# EAGLE schematic motherboard_g4_V1.3 (EAGLE 7.7.0)

## Sheet 1 of 7: CPU
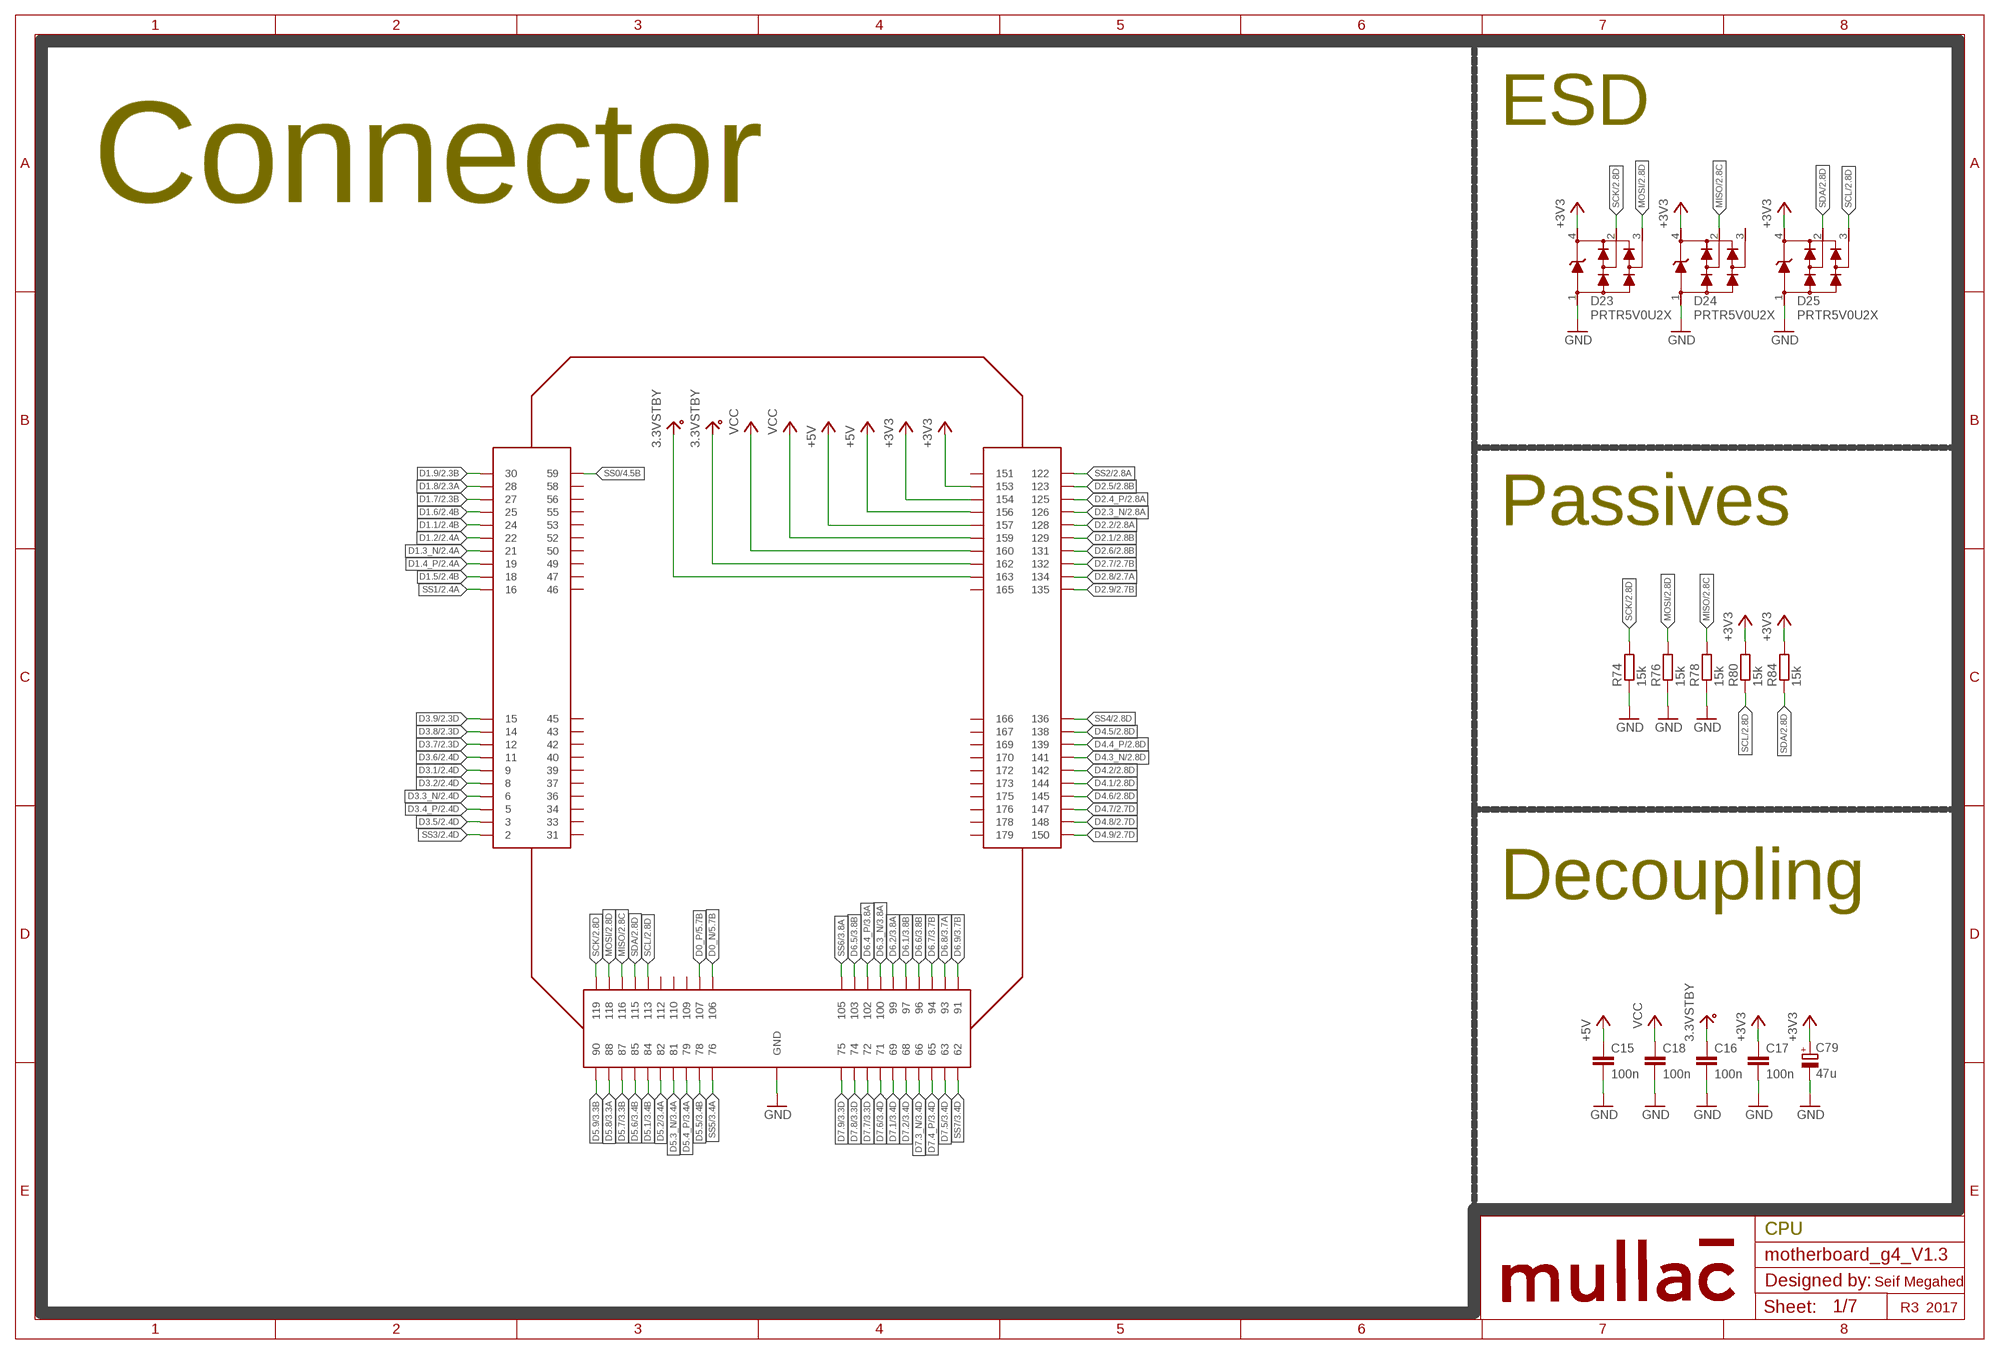
[diagram p0: schematic, sheet 1]

### Parts
C15  100n  CAP_0603  [CAP_0603]
C16  100n  CAP_0603  [CAP_0603]
C17  100n  CAP_0603  [CAP_0603]
C18  100n  CAP_0603  [CAP_0603]
C79  47u  CPOL-EUC  [PANASONIC_C]
D23  PRTR5V0U2X  [SOT143B]
D24  PRTR5V0U2X  [SOT143B]
D25  PRTR5V0U2X  [SOT143B]
R74  15k  RES0603  [RES_0603]
R76  15k  RES0603  [RES_0603]
R78  15k  RES0603  [RES_0603]
R80  15k  RES0603  [RES_0603]
R84  15k  RES0603  [RES_0603]
U$4  SSH-G4-CPUDOCK  [SSH-CPU-DOCK]

### Nets
+3V3: C17.1 C79.+ D23.4 D24.4 D25.4 R80.2 R84.2 U$4.153 U$4.154 ; also sheet 2,3,4,5,6,7
+5V: C15.1 U$4.156 U$4.157 ; also sheet 2,3,7
D0_N [Differential]: U$4.106 ; also sheet 5
D0_P [Differential]: U$4.107 ; also sheet 5
D1.1: U$4.24 ; also sheet 2
D1.2: U$4.22 ; also sheet 2
D1.3_N: U$4.21 ; also sheet 2
D1.4_P: U$4.19 ; also sheet 2
D1.5: U$4.18 ; also sheet 2
D1.6: U$4.25 ; also sheet 2
D1.7: U$4.27 ; also sheet 2
D1.8: U$4.28 ; also sheet 2
D1.9: U$4.30 ; also sheet 2
D2.1: U$4.129 ; also sheet 2
D2.2: U$4.128 ; also sheet 2
D2.3_N: U$4.126 ; also sheet 2
D2.4_P: U$4.125 ; also sheet 2
D2.5: U$4.123 ; also sheet 2
D2.6: U$4.131 ; also sheet 2
D2.7: U$4.132 ; also sheet 2
D2.8: U$4.134 ; also sheet 2
D2.9: U$4.135 ; also sheet 2
D3.1: U$4.9 ; also sheet 2
D3.2: U$4.8 ; also sheet 2
D3.3_N: U$4.6 ; also sheet 2
D3.4_P: U$4.5 ; also sheet 2
D3.5: U$4.3 ; also sheet 2
D3.6: U$4.11 ; also sheet 2
D3.7: U$4.12 ; also sheet 2
D3.8: U$4.14 ; also sheet 2
D3.9: U$4.15 ; also sheet 2
D4.1: U$4.144 ; also sheet 2
D4.2: U$4.142 ; also sheet 2
D4.3_N: U$4.141 ; also sheet 2
D4.4_P: U$4.139 ; also sheet 2
D4.5: U$4.138 ; also sheet 2
D4.6: U$4.145 ; also sheet 2
D4.7: U$4.147 ; also sheet 2
D4.8: U$4.148 ; also sheet 2
D4.9: U$4.150 ; also sheet 2
D5.1: U$4.84 ; also sheet 3
D5.2: U$4.82 ; also sheet 3
D5.3_N: U$4.81 ; also sheet 3
D5.4_P: U$4.79 ; also sheet 3
D5.5: U$4.78 ; also sheet 3
D5.6: U$4.85 ; also sheet 3
D5.7: U$4.87 ; also sheet 3
D5.8: U$4.88 ; also sheet 3
D5.9: U$4.90 ; also sheet 3
D6.1: U$4.97 ; also sheet 3
D6.2: U$4.99 ; also sheet 3
D6.3_N: U$4.100 ; also sheet 3
D6.4_P: U$4.102 ; also sheet 3
D6.5: U$4.103 ; also sheet 3
D6.6: U$4.96 ; also sheet 3
D6.7: U$4.94 ; also sheet 3
D6.8: U$4.93 ; also sheet 3
D6.9: U$4.91 ; also sheet 3
D7.1: U$4.69 ; also sheet 3
D7.2: U$4.68 ; also sheet 3
D7.3_N: U$4.66 ; also sheet 3
D7.4_P: U$4.65 ; also sheet 3
D7.5: U$4.63 ; also sheet 3
D7.6: U$4.71 ; also sheet 3
D7.7: U$4.72 ; also sheet 3
D7.8: U$4.74 ; also sheet 3
D7.9: U$4.75 ; also sheet 3
GND: C15.2 C16.2 C17.2 C18.2 C79.- D23.1 D24.1 D25.1 R74.1 R76.1 R78.1 U$4.1(GND) U$4.4(GND) U$4.7(GND) U$4.10(GND) U$4.13(GND) U$4.17(GND) U$4.20(GND) U$4.23(GND) U$4.26(GND) U$4.29(GND) U$4.32(GND) U$4.35(GND) U$4.38(GND) U$4.41(GND) U$4.44(GND) U$4.48(GND) U$4.51(GND) U$4.54(GND) U$4.57(GND) U$4.60(GND) U$4.61(GND) U$4.64(GND) U$4.67(GND) U$4.70(GND) U$4.73(GND) U$4.77(GND) U$4.80(GND) U$4.83(GND) U$4.86(GND) U$4.89(GND) U$4.92(GND) U$4.95(GND) U$4.98(GND) U$4.101(GND) U$4.104(GND) U$4.108(GND) U$4.111(GND) U$4.114(GND) U$4.117(GND) U$4.120(GND) U$4.121(GND) U$4.124(GND) U$4.127(GND) U$4.130(GND) U$4.133(GND) U$4.137(GND) U$4.140(GND) U$4.143(GND) U$4.146(GND) U$4.149(GND) U$4.152(GND) U$4.155(GND) U$4.158(GND) U$4.161(GND) U$4.164(GND) U$4.168(GND) U$4.171(GND) U$4.174(GND) U$4.177(GND) U$4.180(GND) U$4.P$1(GND) U$4.P$2(GND) U$4.P$3(GND) U$4.P$4(GND) U$4.P$23(GND) U$4.P$24(GND) ; also sheet 2,3,4,5,6,7
MISO: D24.2 R78.2 U$4.116 ; also sheet 2,3,4
MOSI: D23.3 R76.2 U$4.118 ; also sheet 2,3,4
SCK: D23.2 R74.2 U$4.119 ; also sheet 2,3,4
SCL: D25.3 R80.1 U$4.113 ; also sheet 2,3,4
SDA: D25.2 R84.1 U$4.115 ; also sheet 2,3,4
SS0: U$4.59 ; also sheet 4
SS1: U$4.16 ; also sheet 2
SS2: U$4.122 ; also sheet 2
SS3: U$4.2 ; also sheet 2
SS4: U$4.136 ; also sheet 2
SS5: U$4.76 ; also sheet 3
SS6: U$4.105 ; also sheet 3
SS7: U$4.62 ; also sheet 3
STDBY3V3: C16.1 U$4.162 U$4.163 ; supply symbol labelled 3.3VSTBY
VCC: C18.1 U$4.159 U$4.160 ; also sheet 2,3,6,7
Unconnected: D24.3 U$4.31 U$4.33 U$4.34 U$4.36 U$4.37 U$4.39 U$4.40 U$4.42 U$4.43 U$4.45 U$4.46 U$4.47 U$4.49 U$4.50 U$4.52 U$4.53 U$4.55 U$4.56 U$4.58 U$4.109 U$4.110 U$4.112 U$4.151 U$4.165 U$4.166 U$4.167 U$4.169 U$4.170 U$4.172 U$4.173 U$4.175 U$4.176 U$4.178 U$4.179

### Notes on the sheet
- ESD
- Connector
- Passives
- Decoupling
- CPU | CPU
- Seif Megahed
- R3 | 2017

## Sheet 2 of 7: Modules 1
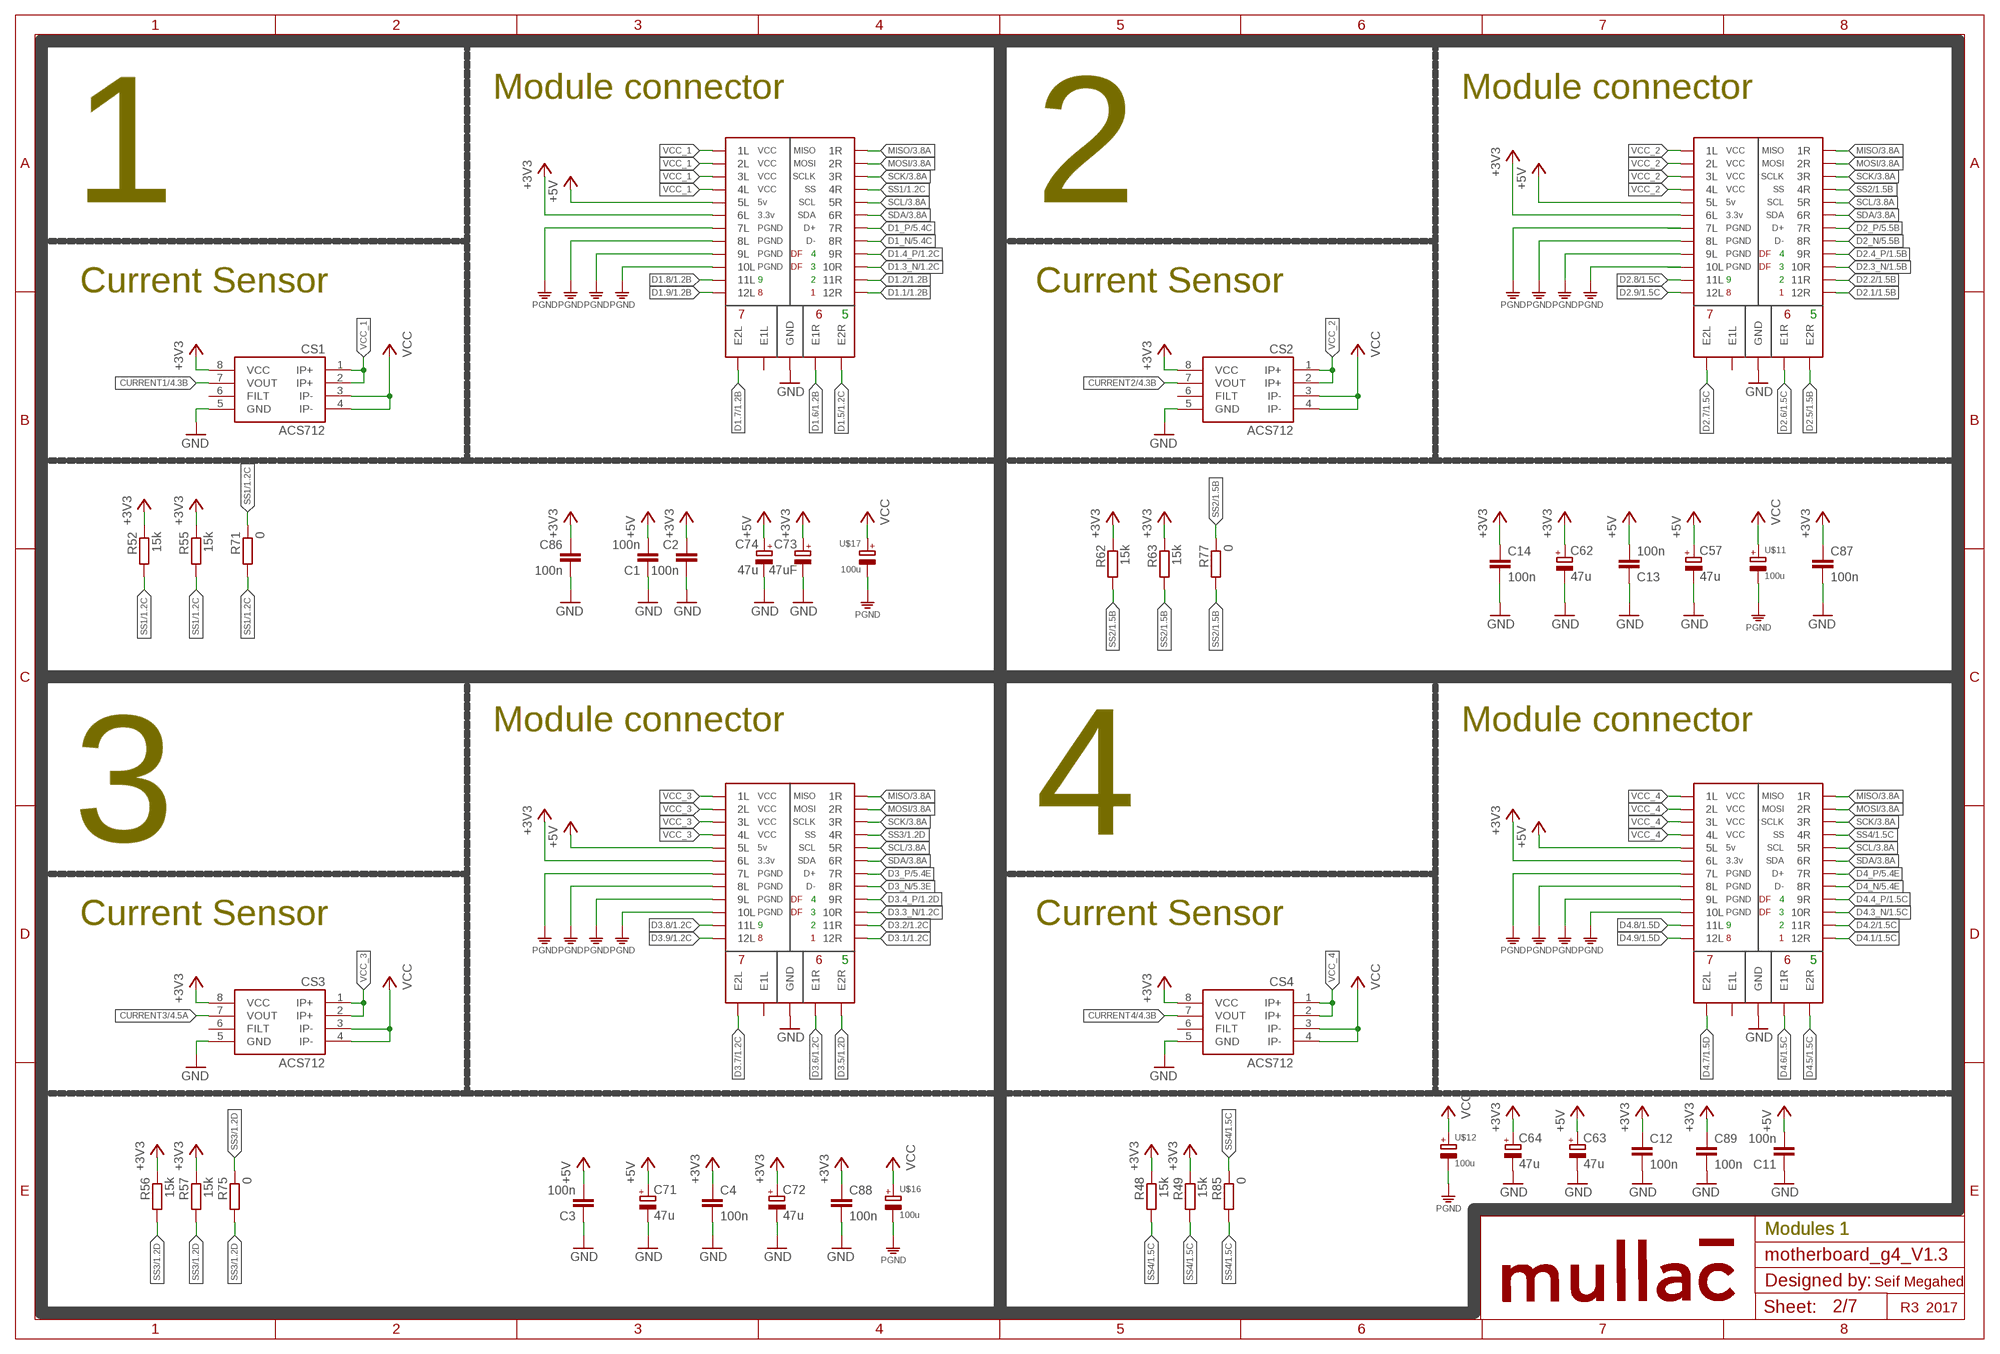
[diagram p1: schematic, sheet 2]

### Parts
C1  100n  CAP_0603  [CAP_0603]
C2  100n  CAP_0603  [CAP_0603]
C3  100n  CAP_0603  [CAP_0603]
C4  100n  CAP_0603  [CAP_0603]
C11  100n  CAP_0603  [CAP_0603]
C12  100n  CAP_0603  [CAP_0603]
C13  100n  CAP_0603  [CAP_0603]
C14  100n  CAP_0603  [CAP_0603]
C57  47u  CPOL-EUC  [PANASONIC_C]
C62  47u  CPOL-EUC  [PANASONIC_C]
C63  47u  CPOL-EUC  [PANASONIC_C]
C64  47u  CPOL-EUC  [PANASONIC_C]
C71  47u  CPOL-EUC  [PANASONIC_C]
C72  47u  CPOL-EUC  [PANASONIC_C]
C73  47uF  CPOL-EUC  [PANASONIC_C]
C74  47u  CPOL-EUC  [PANASONIC_C]
C86  100n  CAP_0603  [CAP_0603]
C87  100n  CAP_0603  [CAP_0603]
C88  100n  CAP_0603  [CAP_0603]
C89  100n  CAP_0603  [CAP_0603]
CS1  ACS712  [SO08]
CS2  ACS712  [SO08]
CS3  ACS712  [SO08]
CS4  ACS712  [SO08]
R48  15k  RES0603  [RES_0603]
R49  15k  RES0603  [RES_0603]
R52  15k  RES0603  [RES_0603]
R55  15k  RES0603  [RES_0603]
R56  15k  RES0603  [RES_0603]
R57  15k  RES0603  [RES_0603]
R62  15k  RES0603  [RES_0603]
R63  15k  RES0603  [RES_0603]
R71  0  RES0603  [RES_0603]
R75  0  RES0603  [RES_0603]
R77  0  RES0603  [RES_0603]
R85  0  RES0603  [RES_0603]
U$5  SSH-G4-MODULEDOCK  [SSH-G4-DOCK]
U$6  SSH-G4-MODULEDOCK  [SSH-G4-DOCK]
U$7  SSH-G4-MODULEDOCK  [SSH-G4-DOCK]
U$8  SSH-G4-MODULEDOCK  [SSH-G4-DOCK]
U$11  100u  CAPACITOR_POLA_EEEFK1V101XP  [AE_CAP_D]
U$12  100u  CAPACITOR_POLA_EEEFK1V101XP  [AE_CAP_D]
U$16  100u  CAPACITOR_POLA_EEEFK1V101XP  [AE_CAP_D]
U$17  100u  CAPACITOR_POLA_EEEFK1V101XP  [AE_CAP_D]

### Nets
+3V3: C2.1 C4.1 C12.1 C14.1 C62.+ C64.+ C72.+ C73.+ C86.1 C87.1 C88.1 C89.1 CS1.8(VCC) CS2.8(VCC) CS3.8(VCC) CS4.8(VCC) R48.1 R49.1 R52.1 R55.1 R56.1 R57.1 R62.1 R63.1 U$5.9SL(6L) U$6.9SL(6L) U$7.9SL(6L) U$8.9SL(6L) ; also sheet 1,3,4,5,6,7
+5V: C1.2 C3.2 C11.2 C13.2 C57.+ C63.+ C71.+ C74.+ U$5.8SL(5L) U$6.8SL(5L) U$7.8SL(5L) U$8.8SL(5L) ; also sheet 1,3,7
CURRENT1: CS1.7(VOUT) ; also sheet 4
CURRENT2: CS2.7(VOUT) ; also sheet 4
CURRENT3: CS3.7(VOUT) ; also sheet 4
CURRENT4: CS4.7(VOUT) ; also sheet 4
D1.1: U$7.21SR(12R) ; also sheet 1
D1.2: U$7.20SR(11R) ; also sheet 1
D1.3_N: U$7.18SR(10R) ; also sheet 1
D1.4_P: U$7.17SR(9R) ; also sheet 1
D1.5: U$7.12ER(E2R) ; also sheet 1
D1.6: U$7.11ER(E1R) ; also sheet 1
D1.7: U$7.12EL(E2L) ; also sheet 1
D1.8: U$7.20SL(11L) ; also sheet 1
D1.9: U$7.21SL(12L) ; also sheet 1
D1_N [Differential]: U$7.15SR(8R) ; also sheet 5
D1_P [Differential]: U$7.14SR(7R) ; also sheet 5
D2.1: U$8.21SR(12R) ; also sheet 1
D2.2: U$8.20SR(11R) ; also sheet 1
D2.3_N: U$8.18SR(10R) ; also sheet 1
D2.4_P: U$8.17SR(9R) ; also sheet 1
D2.5: U$8.12ER(E2R) ; also sheet 1
D2.6: U$8.11ER(E1R) ; also sheet 1
D2.7: U$8.12EL(E2L) ; also sheet 1
D2.8: U$8.20SL(11L) ; also sheet 1
D2.9: U$8.21SL(12L) ; also sheet 1
D2_N [Differential]: U$8.15SR(8R) ; also sheet 5
D2_P [Differential]: U$8.14SR(7R) ; also sheet 5
D3.1: U$5.21SR(12R) ; also sheet 1
D3.2: U$5.20SR(11R) ; also sheet 1
D3.3_N: U$5.18SR(10R) ; also sheet 1
D3.4_P: U$5.17SR(9R) ; also sheet 1
D3.5: U$5.12ER(E2R) ; also sheet 1
D3.6: U$5.11ER(E1R) ; also sheet 1
D3.7: U$5.12EL(E2L) ; also sheet 1
D3.8: U$5.20SL(11L) ; also sheet 1
D3.9: U$5.21SL(12L) ; also sheet 1
D3_N [Differential]: U$5.15SR(8R) ; also sheet 5
D3_P [Differential]: U$5.14SR(7R) ; also sheet 5
D4.1: U$6.21SR(12R) ; also sheet 1
D4.2: U$6.20SR(11R) ; also sheet 1
D4.3_N: U$6.18SR(10R) ; also sheet 1
D4.4_P: U$6.17SR(9R) ; also sheet 1
D4.5: U$6.12ER(E2R) ; also sheet 1
D4.6: U$6.11ER(E1R) ; also sheet 1
D4.7: U$6.12EL(E2L) ; also sheet 1
D4.8: U$6.20SL(11L) ; also sheet 1
D4.9: U$6.21SL(12L) ; also sheet 1
D4_N [Differential]: U$6.15SR(8R) ; also sheet 5
D4_P [Differential]: U$6.14SR(7R) ; also sheet 5
GND: C1.1 C2.2 C3.1 C4.2 C11.1 C12.2 C13.1 C14.2 C57.- C62.- C63.- C64.- C71.- C72.- C73.- C74.- C86.2 C87.2 C88.2 C89.2 CS1.5(GND) CS2.5(GND) CS3.5(GND) CS4.5(GND) U$5.1GL(GND) U$5.1GR(GND) U$5.4GL(GND) U$5.4GR(GND) U$5.7GL(GND) U$5.7GR(GND) U$5.10GL(GND) U$5.10GR(GND) U$5.13GL(GND) U$5.13GR(GND) U$5.16GL(GND) U$5.16GR(GND) U$5.19GL(GND) U$5.19GR(GND) U$5.22GL(GND) U$5.22GR(GND) U$6.1GL(GND) U$6.1GR(GND) U$6.4GL(GND) U$6.4GR(GND) U$6.7GL(GND) U$6.7GR(GND) U$6.10GL(GND) U$6.10GR(GND) U$6.13GL(GND) U$6.13GR(GND) U$6.16GL(GND) U$6.16GR(GND) U$6.19GL(GND) U$6.19GR(GND) U$6.22GL(GND) U$6.22GR(GND) U$7.1GL(GND) U$7.1GR(GND) U$7.4GL(GND) U$7.4GR(GND) U$7.7GL(GND) U$7.7GR(GND) U$7.10GL(GND) U$7.10GR(GND) U$7.13GL(GND) U$7.13GR(GND) U$7.16GL(GND) U$7.16GR(GND) U$7.19GL(GND) U$7.19GR(GND) U$7.22GL(GND) U$7.22GR(GND) U$8.1GL(GND) U$8.1GR(GND) U$8.4GL(GND) U$8.4GR(GND) U$8.7GL(GND) U$8.7GR(GND) U$8.10GL(GND) U$8.10GR(GND) U$8.13GL(GND) U$8.13GR(GND) U$8.16GL(GND) U$8.16GR(GND) U$8.19GL(GND) U$8.19GR(GND) U$8.22GL(GND) U$8.22GR(GND) ; also sheet 1,3,4,5,6,7
MISO: U$5.2SR(1R) U$6.2SR(1R) U$7.2SR(1R) U$8.2SR(1R) ; also sheet 1,3,4
MOSI: U$5.3SR(2R) U$6.3SR(2R) U$7.3SR(2R) U$8.3SR(2R) ; also sheet 1,3,4
PGND: U$7.14SL(7L) U$7.15SL(8L) U$7.17SL(9L) U$7.18SL(10L) U$8.14SL(7L) U$8.15SL(8L) U$8.17SL(9L) U$8.18SL(10L) U$11.- U$12.- U$16.- U$17.- ; also sheet 3,6
SCK: U$5.5SR(3R) U$6.5SR(3R) U$7.5SR(3R) U$8.5SR(3R) ; also sheet 1,3,4
SCL: U$5.8SR(5R) U$6.8SR(5R) U$7.8SR(5R) U$8.8SR(5R) ; also sheet 1,3,4
SDA: U$5.9SR(6R) U$6.9SR(6R) U$7.9SR(6R) U$8.9SR(6R) ; also sheet 1,3,4
SS1: R52.2 R55.2 R71.1 R71.2 U$7.6SR(4R) ; also sheet 1
SS2: R62.2 R63.2 R77.1 R77.2 U$8.6SR(4R) ; also sheet 1
SS3: R56.2 R57.2 R75.1 R75.2 U$5.6SR(4R) ; also sheet 1
SS4: R48.2 R49.2 R85.1 R85.2 U$6.6SR(4R) ; also sheet 1
VCC: CS1.3(IP-) CS1.4(IP-) CS2.3(IP-) CS2.4(IP-) CS3.3(IP-) CS3.4(IP-) CS4.3(IP-) CS4.4(IP-) U$11.+ U$12.+ U$16.+ U$17.+ ; also sheet 1,3,6,7
VCC_1: CS1.1(IP+) CS1.2(IP+) U$7.2SL(1L) U$7.3SL(2L) U$7.5SL(3L) U$7.6SL(4L)
VCC_2: CS2.1(IP+) CS2.2(IP+) U$8.2SL(1L) U$8.3SL(2L) U$8.5SL(3L) U$8.6SL(4L)
VCC_3: CS3.1(IP+) CS3.2(IP+) U$5.2SL(1L) U$5.3SL(2L) U$5.5SL(3L) U$5.6SL(4L)
VCC_4: CS4.1(IP+) CS4.2(IP+) U$6.2SL(1L) U$6.3SL(2L) U$6.5SL(3L) U$6.6SL(4L)
Unconnected: CS1.6(FILT) CS2.6(FILT) CS3.6(FILT) CS4.6(FILT) U$5.11EL(E1L) U$5.14SL(7L) U$5.15SL(8L) U$5.17SL(9L) U$5.18SL(10L) U$6.11EL(E1L) U$6.14SL(7L) U$6.15SL(8L) U$6.17SL(9L) U$6.18SL(10L) U$7.11EL(E1L) U$8.11EL(E1L)

### Notes on the sheet
- 1 | Module connector | 2 | Module connector
- Current Sensor | Current Sensor
- 3 | Module connector | 4 | Module connector
- Current Sensor | Current Sensor
- Modules 1 | Modules 1
- Seif Megahed
- R3 | 2017

## Sheet 3 of 7: Modules 2
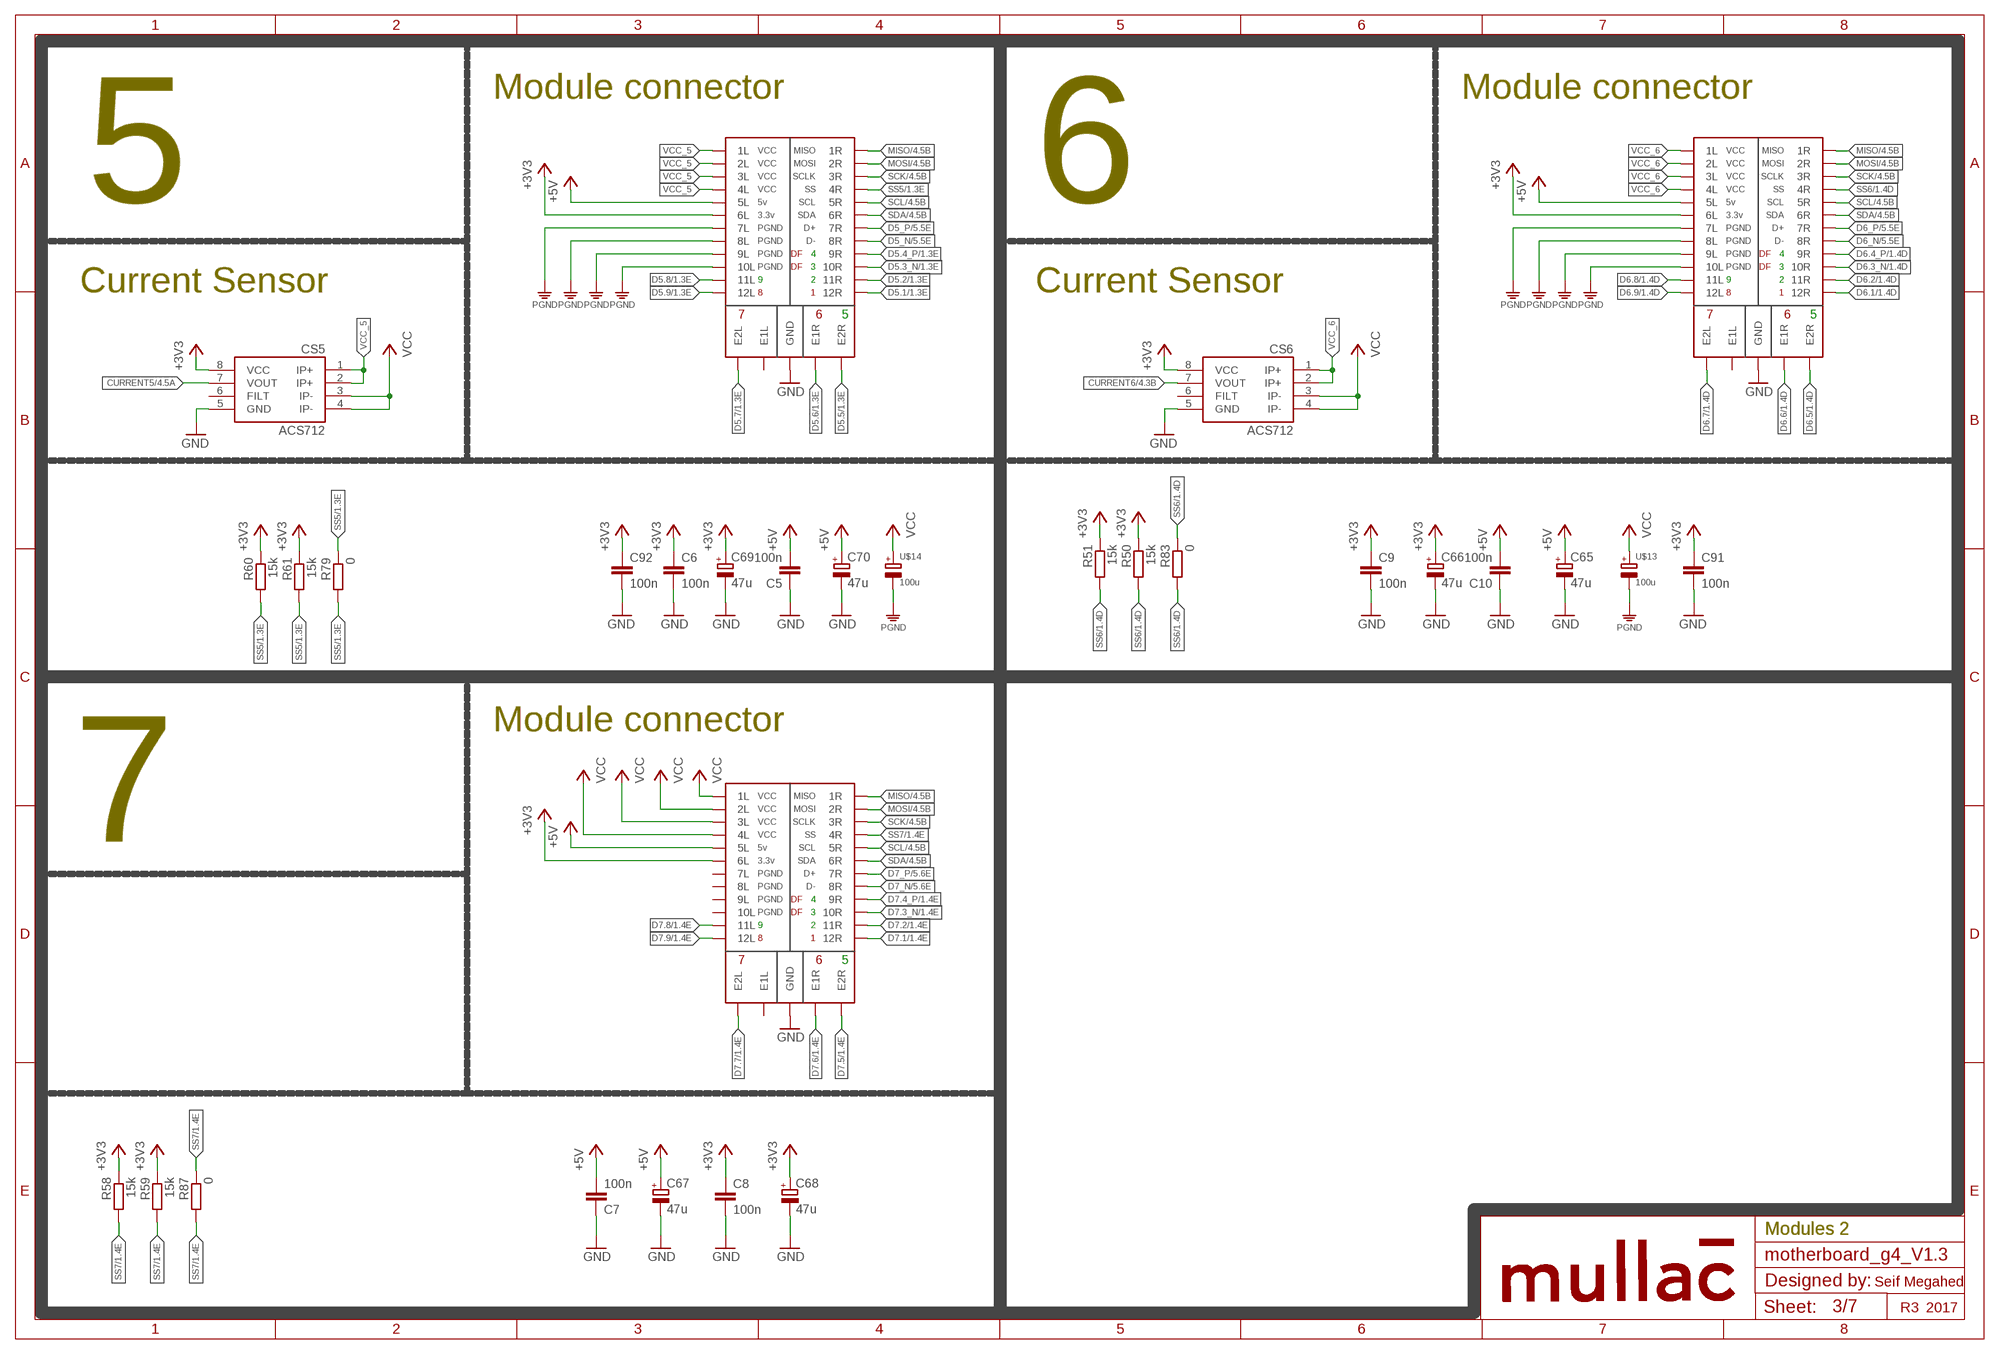
[diagram p2: schematic, sheet 3]

### Parts
C5  100n  CAP_0603  [CAP_0603]
C6  100n  CAP_0603  [CAP_0603]
C7  100n  CAP_0603  [CAP_0603]
C8  100n  CAP_0603  [CAP_0603]
C9  100n  CAP_0603  [CAP_0603]
C10  100n  CAP_0603  [CAP_0603]
C65  47u  CPOL-EUC  [PANASONIC_C]
C66  47u  CPOL-EUC  [PANASONIC_C]
C67  47u  CPOL-EUC  [PANASONIC_C]
C68  47u  CPOL-EUC  [PANASONIC_C]
C69  47u  CPOL-EUC  [PANASONIC_C]
C70  47u  CPOL-EUC  [PANASONIC_C]
C91  100n  CAP_0603  [CAP_0603]
C92  100n  CAP_0603  [CAP_0603]
CS5  ACS712  [SO08]
CS6  ACS712  [SO08]
R50  15k  RES0603  [RES_0603]
R51  15k  RES0603  [RES_0603]
R58  15k  RES0603  [RES_0603]
R59  15k  RES0603  [RES_0603]
R60  15k  RES0603  [RES_0603]
R61  15k  RES0603  [RES_0603]
R79  0  RES0603  [RES_0603]
R83  0  RES0603  [RES_0603]
R87  0  RES0603  [RES_0603]
U$1  SSH-G4-MODULEDOCK  [SSH-G4-DOCK]
U$2  SSH-G4-MODULEDOCK  [SSH-G4-DOCK]
U$3  SSH-G4-MODULESENSOR_DOCK  [SSH-SENSOR-G4-DOCK]
U$13  100u  CAPACITOR_POLA_EEEFK1V101XP  [AE_CAP_D]
U$14  100u  CAPACITOR_POLA_EEEFK1V101XP  [AE_CAP_D]

### Nets
+3V3: C6.1 C8.1 C9.1 C66.+ C68.+ C69.+ C91.1 C92.1 CS5.8(VCC) CS6.8(VCC) R50.1 R51.1 R58.1 R59.1 R60.1 R61.1 U$1.9SL(6L) U$2.9SL(6L) U$3.9SL(6L) ; also sheet 1,2,4,5,6,7
+5V: C5.2 C7.2 C10.2 C65.+ C67.+ C70.+ U$1.8SL(5L) U$2.8SL(5L) U$3.8SL(5L) ; also sheet 1,2,7
CURRENT5: CS5.7(VOUT) ; also sheet 4
CURRENT6: CS6.7(VOUT) ; also sheet 4
D5.1: U$1.21SR(12R) ; also sheet 1
D5.2: U$1.20SR(11R) ; also sheet 1
D5.3_N: U$1.18SR(10R) ; also sheet 1
D5.4_P: U$1.17SR(9R) ; also sheet 1
D5.5: U$1.12ER(E2R) ; also sheet 1
D5.6: U$1.11ER(E1R) ; also sheet 1
D5.7: U$1.12EL(E2L) ; also sheet 1
D5.8: U$1.20SL(11L) ; also sheet 1
D5.9: U$1.21SL(12L) ; also sheet 1
D5_N [Differential]: U$1.15SR(8R) ; also sheet 5
D5_P [Differential]: U$1.14SR(7R) ; also sheet 5
D6.1: U$2.21SR(12R) ; also sheet 1
D6.2: U$2.20SR(11R) ; also sheet 1
D6.3_N: U$2.18SR(10R) ; also sheet 1
D6.4_P: U$2.17SR(9R) ; also sheet 1
D6.5: U$2.12ER(E2R) ; also sheet 1
D6.6: U$2.11ER(E1R) ; also sheet 1
D6.7: U$2.12EL(E2L) ; also sheet 1
D6.8: U$2.20SL(11L) ; also sheet 1
D6.9: U$2.21SL(12L) ; also sheet 1
D6_N [Differential]: U$2.15SR(8R) ; also sheet 5
D6_P [Differential]: U$2.14SR(7R) ; also sheet 5
D7.1: U$3.21SR(12R) ; also sheet 1
D7.2: U$3.20SR(11R) ; also sheet 1
D7.3_N: U$3.18SR(10R) ; also sheet 1
D7.4_P: U$3.17SR(9R) ; also sheet 1
D7.5: U$3.12ER(E2R) ; also sheet 1
D7.6: U$3.11ER(E1R) ; also sheet 1
D7.7: U$3.12EL(E2L) ; also sheet 1
D7.8: U$3.20SL(11L) ; also sheet 1
D7.9: U$3.21SL(12L) ; also sheet 1
D7_N [Differential]: U$3.15SR(8R) ; also sheet 5
D7_P [Differential]: U$3.14SR(7R) ; also sheet 5
GND: C5.1 C6.2 C7.1 C8.2 C9.2 C10.1 C65.- C66.- C67.- C68.- C69.- C70.- C91.2 C92.2 CS5.5(GND) CS6.5(GND) U$1.1GL(GND) U$1.1GR(GND) U$1.4GL(GND) U$1.4GR(GND) U$1.7GL(GND) U$1.7GR(GND) U$1.10GL(GND) U$1.10GR(GND) U$1.13GL(GND) U$1.13GR(GND) U$1.16GL(GND) U$1.16GR(GND) U$1.19GL(GND) U$1.19GR(GND) U$1.22GL(GND) U$1.22GR(GND) U$2.1GL(GND) U$2.1GR(GND) U$2.4GL(GND) U$2.4GR(GND) U$2.7GL(GND) U$2.7GR(GND) U$2.10GL(GND) U$2.10GR(GND) U$2.13GL(GND) U$2.13GR(GND) U$2.16GL(GND) U$2.16GR(GND) U$2.19GL(GND) U$2.19GR(GND) U$2.22GL(GND) U$2.22GR(GND) U$3.1GL(GND) U$3.1GR(GND) U$3.4GL(GND) U$3.4GR(GND) U$3.7GL(GND) U$3.7GR(GND) U$3.10GL(GND) U$3.10GR(GND) U$3.13GL(GND) U$3.13GR(GND) U$3.16GL(GND) U$3.16GR(GND) U$3.19GL(GND) U$3.19GR(GND) U$3.22GL(GND) U$3.22GR(GND) ; also sheet 1,2,4,5,6,7
MISO: U$1.2SR(1R) U$2.2SR(1R) U$3.2SR(1R) ; also sheet 1,2,4
MOSI: U$1.3SR(2R) U$2.3SR(2R) U$3.3SR(2R) ; also sheet 1,2,4
PGND: U$13.- U$14.- ; also sheet 2,6
SCK: U$1.5SR(3R) U$2.5SR(3R) U$3.5SR(3R) ; also sheet 1,2,4
SCL: U$1.8SR(5R) U$2.8SR(5R) U$3.8SR(5R) ; also sheet 1,2,4
SDA: U$1.9SR(6R) U$2.9SR(6R) U$3.9SR(6R) ; also sheet 1,2,4
SS5: R60.2 R61.2 R79.1 R79.2 U$1.6SR(4R) ; also sheet 1
SS6: R50.2 R51.2 R83.1 R83.2 U$2.6SR(4R) ; also sheet 1
SS7: R58.2 R59.2 R87.1 R87.2 U$3.6SR(4R) ; also sheet 1
VCC: CS5.3(IP-) CS5.4(IP-) CS6.3(IP-) CS6.4(IP-) U$3.2SL(1L) U$3.3SL(2L) U$3.5SL(3L) U$3.6SL(4L) U$13.+ U$14.+ ; also sheet 1,2,6,7
VCC_5: CS5.1(IP+) CS5.2(IP+) U$1.2SL(1L) U$1.3SL(2L) U$1.5SL(3L) U$1.6SL(4L)
VCC_6: CS6.1(IP+) CS6.2(IP+) U$2.2SL(1L) U$2.3SL(2L) U$2.5SL(3L) U$2.6SL(4L)
Unconnected: CS5.6(FILT) CS6.6(FILT) U$1.11EL(E1L) U$1.14SL(7L) U$1.15SL(8L) U$1.17SL(9L) U$1.18SL(10L) U$2.11EL(E1L) U$2.14SL(7L) U$2.15SL(8L) U$2.17SL(9L) U$2.18SL(10L) U$3.11EL(E1L) U$3.14SL(7L) U$3.15SL(8L) U$3.17SL(9L) U$3.18SL(10L)

### Notes on the sheet
- 5 | Module connector | 6 | Module connector
- Current Sensor | Current Sensor
- 7 | Module connector
- Modules 2 | Modules 2
- Seif Megahed
- R3 | 2017

## Sheet 4 of 7: MCU
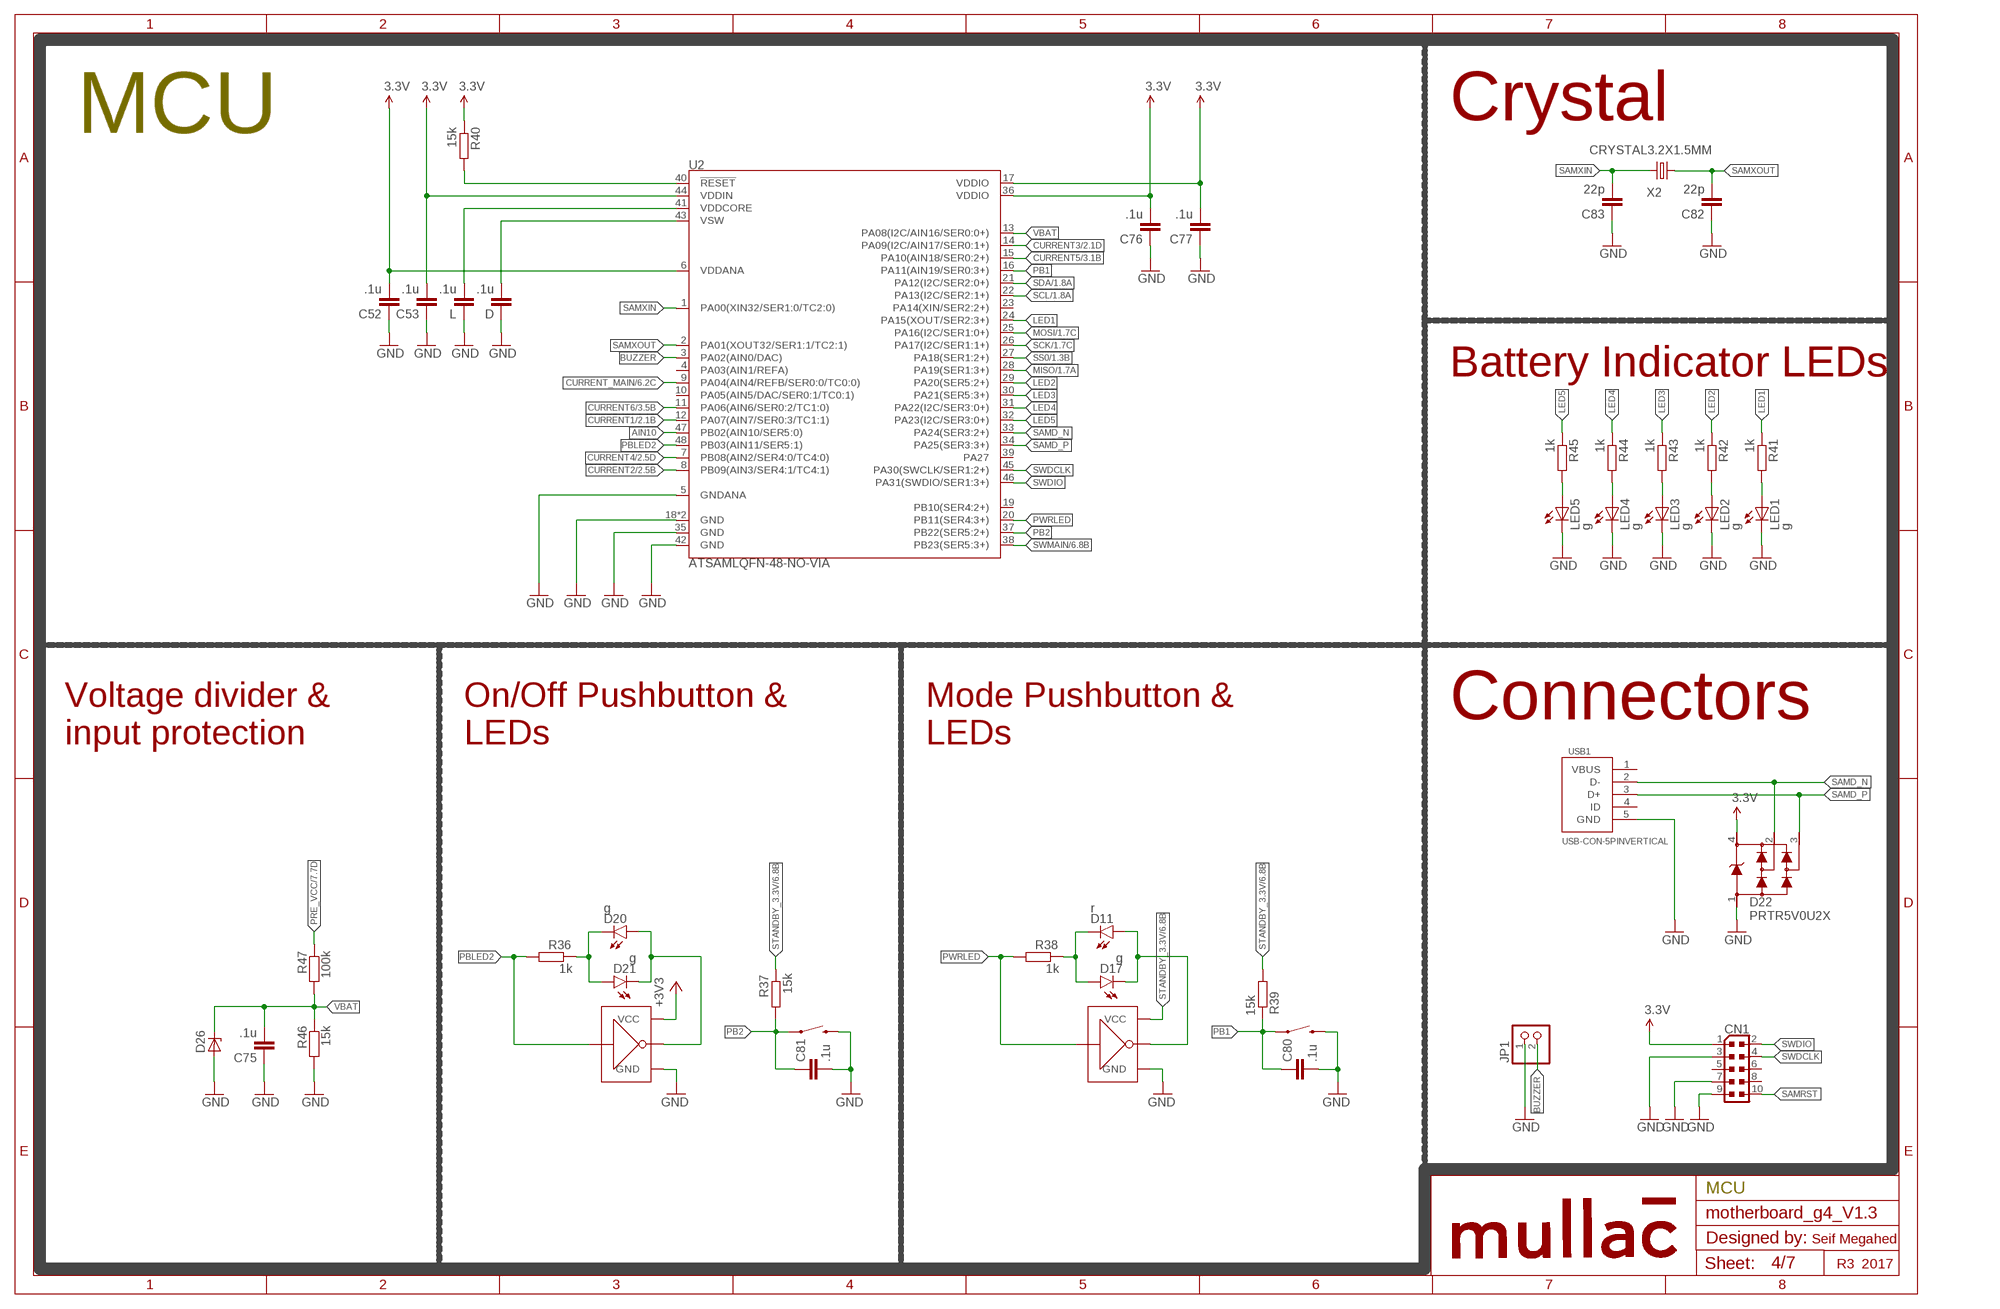
[diagram p3: schematic, sheet 4]

### Parts
C52  .1u  CAP_0603  [CAP_0603]
C53  .1u  CAP_0603  [CAP_0603]
C75  .1u  CAP_0603  [CAP_0603]
C76  .1u  CAP_0603  [CAP_0603]
C77  .1u  CAP_0603  [CAP_0603]
C80  .1u  CAP_0603  [CAP_0603]
C81  .1u  CAP_0603  [CAP_0603]
C82  22p  CAP_0603  [CAP_0603]
C83  22p  CAP_0603  [CAP_0603]
CN1  SWD_0171_PH127-205DF055G00AROUND-PADS  [SWD_PINHEAD_2X05_127]
D  .1u  CAP_0603  [CAP_0603]
D11  r  LED0603  [LED-0603]
D17  g  LED0603  [LED-0603]
D20  g  LED0603  [LED-0603]
D21  g  LED0603  [LED-0603]
D22  PRTR5V0U2X  [SOT143B]
D26  http://nl.farnell.com/diodes-inc/dz23c3v3-7-f/diode-dual-zener-3-3v-0-3w-sot23/dp/1773580  ZENER-DIODESOT23  [SOT23]
JP1  PINHD-1X2  [1X02]
L  .1u  CAP_0603  [CAP_0603]
LED1  g  LEDCHIP-LED0603  [CHIP-LED0603]
LED2  g  LEDCHIP-LED0603  [CHIP-LED0603]
LED3  g  LEDCHIP-LED0603  [CHIP-LED0603]
LED4  g  LEDCHIP-LED0603  [CHIP-LED0603]
LED5  g  LEDCHIP-LED0603  [CHIP-LED0603]
NOT1  NOT_GATE7404_SOT23-5  [SOT23-5]
NOT2  NOT_GATE7404_SOT23-5  [SOT23-5]
R36  1k  RESISTOR_0603  [0603]
R37  15k  RESISTOR_0603  [0603]
R38  1k  RESISTOR_0603  [0603]
R39  15k  RESISTOR_0603  [0603]
R40  15k  RES0603  [RES_0603]
R41  1k  RES0603  [RES_0603]
R42  1k  RES0603  [RES_0603]
R43  1k  RES0603  [RES_0603]
R44  1k  RES0603  [RES_0603]
R45  1k  RES0603  [RES_0603]
R46  15k  RES0603  [RES_0603]
R47  100k  RES0603  [RES_0603]
U2  ATSAMLQFN-48-NO-VIA  [QFN-48-NO-VIAS]
U$31  http://nl.mouser.com/ProductDetail/Omron-Electronics/B3FS-4052P/?qs=sGAEpiMZZMsgGjVA3toVBL1indp2geJfyyO2cWVY0Hg%3d  TACT-SWITCHTACT12/12  [TACT12X12]
U$32  http://nl.mouser.com/ProductDetail/Omron-Electronics/B3FS-4052P/?qs=sGAEpiMZZMsgGjVA3toVBL1indp2geJfyyO2cWVY0Hg%3d  TACT-SWITCHTACT12/12  [TACT12X12]
USB1  USB-CON-5PINVERTICAL  [USB-MICRO-3131-V]
X2  CRYSTAL3.2X1.5MM  [CRYSTAL-SMD-3.2X1.5MM]

### Nets
+3V3: NOT2.5(VCC) ; also sheet 1,2,3,5,6,7
AIN10: U2.47(PB02(AIN10/SER5:0))
BUZZER: JP1.2 U2.3(PA02(AIN0/DAC))
CURRENT1: U2.12(PA07(AIN7/SER0:3/TC1:1)) ; also sheet 2
CURRENT2: U2.8(PB09(AIN3/SER4:1/TC4:1)) ; also sheet 2
CURRENT3: U2.14(PA09(I2C/AIN17/SER0:1+)) ; also sheet 2
CURRENT4: U2.7(PB08(AIN2/SER4:0/TC4:0)) ; also sheet 2
CURRENT5: U2.15(PA10(AIN18/SER0:2+)) ; also sheet 3
CURRENT6: U2.11(PA06(AIN6/SER0:2/TC1:0)) ; also sheet 3
CURRENT_MAIN: U2.9(PA04(AIN4/REFB/SER0:0/TC0:0)) ; also sheet 6
D: D.2 U2.43(VSW)
GND: C52.1 C53.1 C75.1 C76.1 C77.1 C80.2 C81.2 C82.1 C83.1 CN1.3 CN1.7 CN1.9 D22.1 D26.1(A) D.1 JP1.1 L.1 LED1.C LED2.C LED3.C LED4.C LED5.C NOT1.3(GND) NOT2.3(GND) R46.2 U2.5(GNDANA) U2.18(GND) U2.35(GND) U2.42(GND) U2.EP(GND) U$31.3 U$31.4 U$32.3 U$32.4 USB1.5(GND) ; also sheet 1,2,3,5,6,7
L: L.2 U2.41(VDDCORE)
LED1: R41.1 U2.24(PA15(XOUT/SER2:3+))
LED2: R42.1 U2.29(PA20(SER5:2+))
LED3: R43.1 U2.30(PA21(SER5:3+))
LED4: R44.1 U2.31(PA22(I2C/SER3:0+))
LED5: R45.1 U2.32(PA23(I2C/SER3:0+))
MISO: U2.28(PA19(SER1:3+)) ; also sheet 1,2,3
MOSI: U2.25(PA16(I2C/SER1:0+)) ; also sheet 1,2,3
N$12: D20.C D21.A R36.P$1
N$19: D11.C D17.A R38.P$1
N$33: D11.A D17.C NOT1.4(Y)
N$39: D20.A D21.C NOT2.4(Y)
N$42: LED5.A R45.2
N$43: LED4.A R44.2
N$44: LED3.A R43.2
N$53: LED2.A R42.2
N$54: LED1.A R41.2
PB1: C80.1 R39.P$1 U2.16(PA11(AIN19/SER0:3+)) U$31.1 U$31.2
PB2: C81.1 R37.P$2 U2.37(PB22(SER5:2+)) U$32.1 U$32.2
PBLED2: NOT2.2(A) R36.P$2 U2.48(PB03(AIN11/SER5:1))
PRE_VCC: R47.1 ; also sheet 6,7
PWRLED: NOT1.2(A) R38.P$2 U2.20(PB11(SER4:3+))
SAMD_N [Differential]: D22.2 U2.33(PA24(SER3:2+)) USB1.2(D-)
SAMD_P [Differential]: D22.3 U2.34(PA25(SER3:3+)) USB1.3(D+)
SAMRST: CN1.10 R40.2 U2.40(!RESET!)
SAMXIN: C83.2 U2.1(PA00(XIN32/SER1:0/TC2:0)) X2.P$2
SAMXOUT: C82.2 U2.2(PA01(XOUT32/SER1:1/TC2:1)) X2.P$1
SCK: U2.26(PA17(I2C/SER1:1+)) ; also sheet 1,2,3
SCL: U2.22(PA13(I2C/SER2:1+)) ; also sheet 1,2,3
SDA: U2.21(PA12(I2C/SER2:0+)) ; also sheet 1,2,3
SS0: U2.27(PA18(SER1:2+)) ; also sheet 1
STANDBY_3.3V: C52.2 C53.2 C76.2 C77.2 CN1.1 D22.4 NOT1.5(VCC) R37.P$1 R39.P$2 R40.1 U2.6(VDDANA) U2.17(VDDIO) U2.36(VDDIO) U2.44(VDDIN) ; supply symbol labelled 3.3V ; also sheet 6,7
SWDCLK: CN1.4 U2.45(PA30(SWCLK/SER1:2+))
SWDIO: CN1.2 U2.46(PA31(SWDIO/SER1:3+))
SWMAIN: U2.38(PB23(SER5:3+)) ; also sheet 6
VBAT: C75.2 D26.3(C) R46.1 R47.2 U2.13(PA08(I2C/AIN16/SER0:0+))
Unconnected: CN1.5 CN1.6 CN1.8 U2.4(PA03(AIN1/REFA)) U2.10(PA05(AIN5/DAC/SER0:1/TC0:1)) U2.19(PB10(SER4:2+)) U2.23(PA14(XIN/SER2:2+)) U2.39(PA27) USB1.4(ID)

### Notes on the sheet
- MCU | Crystal
- Battery Indicator LEDs
- Connectors
- Voltage divider &
  input protection
- On/Off Pushbutton &
  LEDs
- Mode Pushbutton &
  LEDs
- MCU
- Seif Megahed
- R3 | 2017

## Sheet 5 of 7: USB HUB
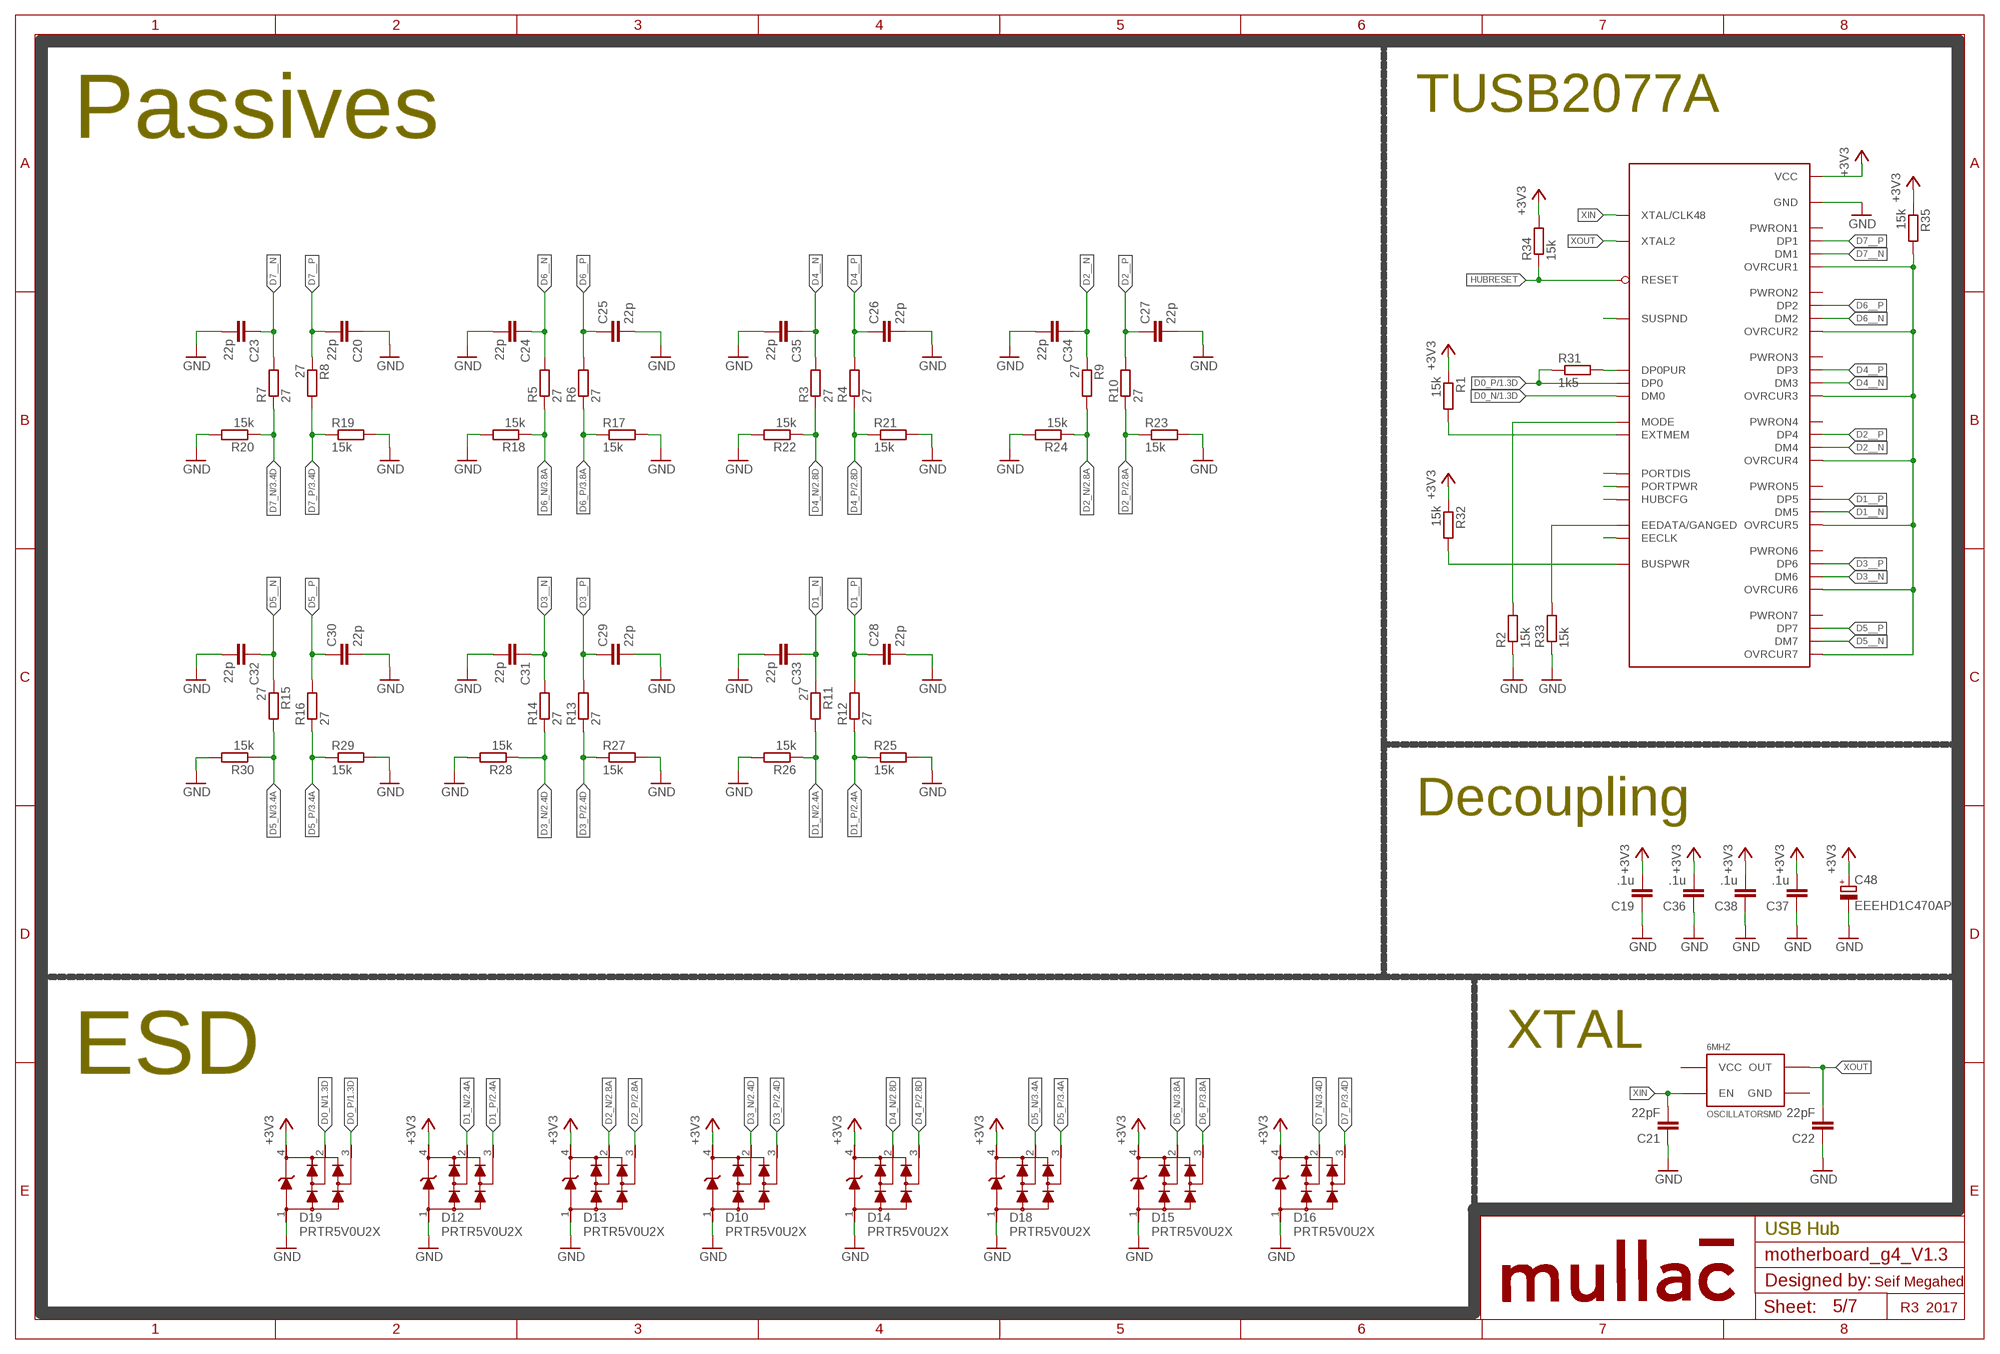
[diagram p4: schematic, sheet 5]

### Parts
6MHZ  OSCILLATORSMD  [CRYSTAL-SMD-7X5]
C19  .1u  CAP_0603  [CAP_0603]
C20  22p  CAP_0603  [CAP_0603]
C21  22pF  CAP_0603  [CAP_0603]
C22  22pF  CAP_0603  [CAP_0603]
C23  22p  CAP_0603  [CAP_0603]
C24  22p  CAP_0603  [CAP_0603]
C25  22p  CAP_0603  [CAP_0603]
C26  22p  CAP_0603  [CAP_0603]
C27  22p  CAP_0603  [CAP_0603]
C28  22p  CAP_0603  [CAP_0603]
C29  22p  CAP_0603  [CAP_0603]
C30  22p  CAP_0603  [CAP_0603]
C31  22p  CAP_0603  [CAP_0603]
C32  22p  CAP_0603  [CAP_0603]
C33  22p  CAP_0603  [CAP_0603]
C34  22p  CAP_0603  [CAP_0603]
C35  22p  CAP_0603  [CAP_0603]
C36  .1u  CAP_0603  [CAP_0603]
C37  .1u  CAP_0603  [CAP_0603]
C38  .1u  CAP_0603  [CAP_0603]
C48  EEEHD1C470AP  CPOL-EUC  [PANASONIC_C]
D10  PRTR5V0U2X  [SOT143B]
D12  PRTR5V0U2X  [SOT143B]
D13  PRTR5V0U2X  [SOT143B]
D14  PRTR5V0U2X  [SOT143B]
D15  PRTR5V0U2X  [SOT143B]
D16  PRTR5V0U2X  [SOT143B]
D18  PRTR5V0U2X  [SOT143B]
D19  PRTR5V0U2X  [SOT143B]
R1  15k  RES0603  [RES_0603]
R2  15k  RES0603  [RES_0603]
R3  27  RES0603  [RES_0603]
R4  27  RES0603  [RES_0603]
R5  27  RES0603  [RES_0603]
R6  27  RES0603  [RES_0603]
R7  27  RES0603  [RES_0603]
R8  27  RES0603  [RES_0603]
R9  27  RES0603  [RES_0603]
R10  27  RES0603  [RES_0603]
R11  27  RES0603  [RES_0603]
R12  27  RES0603  [RES_0603]
R13  27  RES0603  [RES_0603]
R14  27  RES0603  [RES_0603]
R15  27  RES0603  [RES_0603]
R16  27  RES0603  [RES_0603]
R17  15k  RES0603  [RES_0603]
R18  15k  RES0603  [RES_0603]
R19  15k  RES0603  [RES_0603]
R20  15k  RES0603  [RES_0603]
R21  15k  RES0603  [RES_0603]
R22  15k  RES0603  [RES_0603]
R23  15k  RES0603  [RES_0603]
R24  15k  RES0603  [RES_0603]
R25  15k  RES0603  [RES_0603]
R26  15k  RES0603  [RES_0603]
R27  15k  RES0603  [RES_0603]
R28  15k  RES0603  [RES_0603]
R29  15k  RES0603  [RES_0603]
R30  15k  RES0603  [RES_0603]
R31  1k5  RES0603  [RES_0603]
R32  15k  RES0603  [RES_0603]
R33  15k  RES0603  [RES_0603]
R34  15k  RES0603  [RES_0603]
R35  15k  RES0603  [RES_0603]
U1  TUSB2077ALQFP-48  [LQFP-48]

### Nets
+3V3: C19.2 C36.2 C37.2 C38.2 C48.+ D10.4 D12.4 D13.4 D14.4 D15.4 D16.4 D18.4 D19.4 R1.1 R32.1 R34.2 R35.1 U1.9(VCC) U1.46(VCC) ; also sheet 1,2,3,4,6,7
BUSPWR: R32.2 U1.10(BUSPWR)
D0_N [Differential]: D19.2 U1.4(DM0) ; also sheet 1
D0_P [Differential]: D19.3 R31.1 U1.3(DP0) ; also sheet 1
D1__N [Differential]: C33.1 R11.1 U1.30(DM5)
D1__P [Differential]: C28.1 R12.2 U1.31(DP5)
D1_N [Differential]: D12.2 R11.2 R26.1 ; also sheet 2
D1_P [Differential]: D12.3 R12.1 R25.1 ; also sheet 2
D2__N [Differential]: C34.1 R9.1 U1.26(DM4)
D2__P [Differential]: C27.1 R10.2 U1.27(DP4)
D2_N [Differential]: D13.2 R9.2 R24.1 ; also sheet 2
D2_P [Differential]: D13.3 R10.1 R23.1 ; also sheet 2
D3__N [Differential]: C31.1 R14.2 U1.34(DM6)
D3__P [Differential]: C29.1 R13.2 U1.35(DP6)
D3_N [Differential]: D10.2 R14.1 R28.1 ; also sheet 2
D3_P [Differential]: D10.3 R13.1 R27.1 ; also sheet 2
D4__N [Differential]: C35.1 R3.2 U1.21(DM3)
D4__P [Differential]: C26.1 R4.2 U1.22(DP3)
D4_N [Differential]: D14.2 R3.1 R22.1 ; also sheet 2
D4_P [Differential]: D14.3 R4.1 R21.1 ; also sheet 2
D5__N [Differential]: C32.1 R15.1 U1.38(DM7)
D5__P [Differential]: C30.1 R16.2 U1.39(DP7)
D5_N [Differential]: D18.2 R15.2 R30.1 ; also sheet 3
D5_P [Differential]: D18.3 R16.1 R29.1 ; also sheet 3
D6__N [Differential]: C24.1 R5.2 U1.17(DM2)
D6__P [Differential]: C25.1 R6.2 U1.18(DP2)
D6_N [Differential]: D15.2 R5.1 R18.1 ; also sheet 3
D6_P [Differential]: D15.3 R6.1 R17.1 ; also sheet 3
D7__N [Differential]: C23.1 R7.2 U1.13(DM1)
D7__P [Differential]: C20.2 R8.1 U1.14(DP1)
D7_N [Differential]: D16.2 R7.1 R20.1 ; also sheet 3
D7_P [Differential]: D16.3 R8.2 R19.1 ; also sheet 3
DPUR: R31.2 U1.2(DP0PUR)
EEDATA: R33.2 U1.8(EEDATA/GANGED)
EXTMEM: R1.2 U1.47(EXTMEM)
GND: C19.1 C20.1 C21.1 C22.1 C23.2 C24.2 C25.2 C26.2 C27.2 C28.2 C29.2 C30.2 C31.2 C32.2 C33.2 C34.2 C35.2 C36.1 C37.1 C38.1 C48.- D10.1 D12.1 D13.1 D14.1 D15.1 D16.1 D18.1 D19.1 R2.1 R17.2 R18.2 R19.2 R20.2 R21.2 R22.2 R23.2 R24.2 R25.2 R26.2 R27.2 R28.2 R29.2 R30.2 R33.1 U1.5(GND) U1.24(GND) U1.43(GND) ; also sheet 1,2,3,4,6,7
HUBRESET: R34.1 U1.6(RESET)
MODE: R2.2 U1.48(MODE)
N$14: U1.7(EECLK)
N$16: U1.40(HUBCFG)
N$45: U1.41(PORTPWR)
N$47: U1.42(PORTDIS)
N$48: U1.1(SUSPND)
OC: R35.2 U1.12(OVRCUR1) U1.16(OVRCUR2) U1.20(OVRCUR3) U1.25(OVRCUR4) U1.29(OVRCUR5) U1.33(OVRCUR6) U1.37(OVRCUR7)
XIN: 6MHZ.P$1(EN) C21.2 U1.45(XTAL/CLK48)
XOUT: 6MHZ.P$3(OUT) C22.2 U1.44(XTAL2)
Unconnected: 6MHZ.P$2(GND) 6MHZ.P$4(VCC) U1.11(PWRON1) U1.15(PWRON2) U1.19(PWRON3) U1.23(PWRON4) U1.28(PWRON5) U1.32(PWRON6) U1.36(PWRON7)

### Notes on the sheet
- Passives | TUSB2077A
- Decoupling
- ESD | XTAL
- USB Hub | USB Hub
- Seif Megahed
- R3 | 2017

## Sheet 6 of 7: Power Input
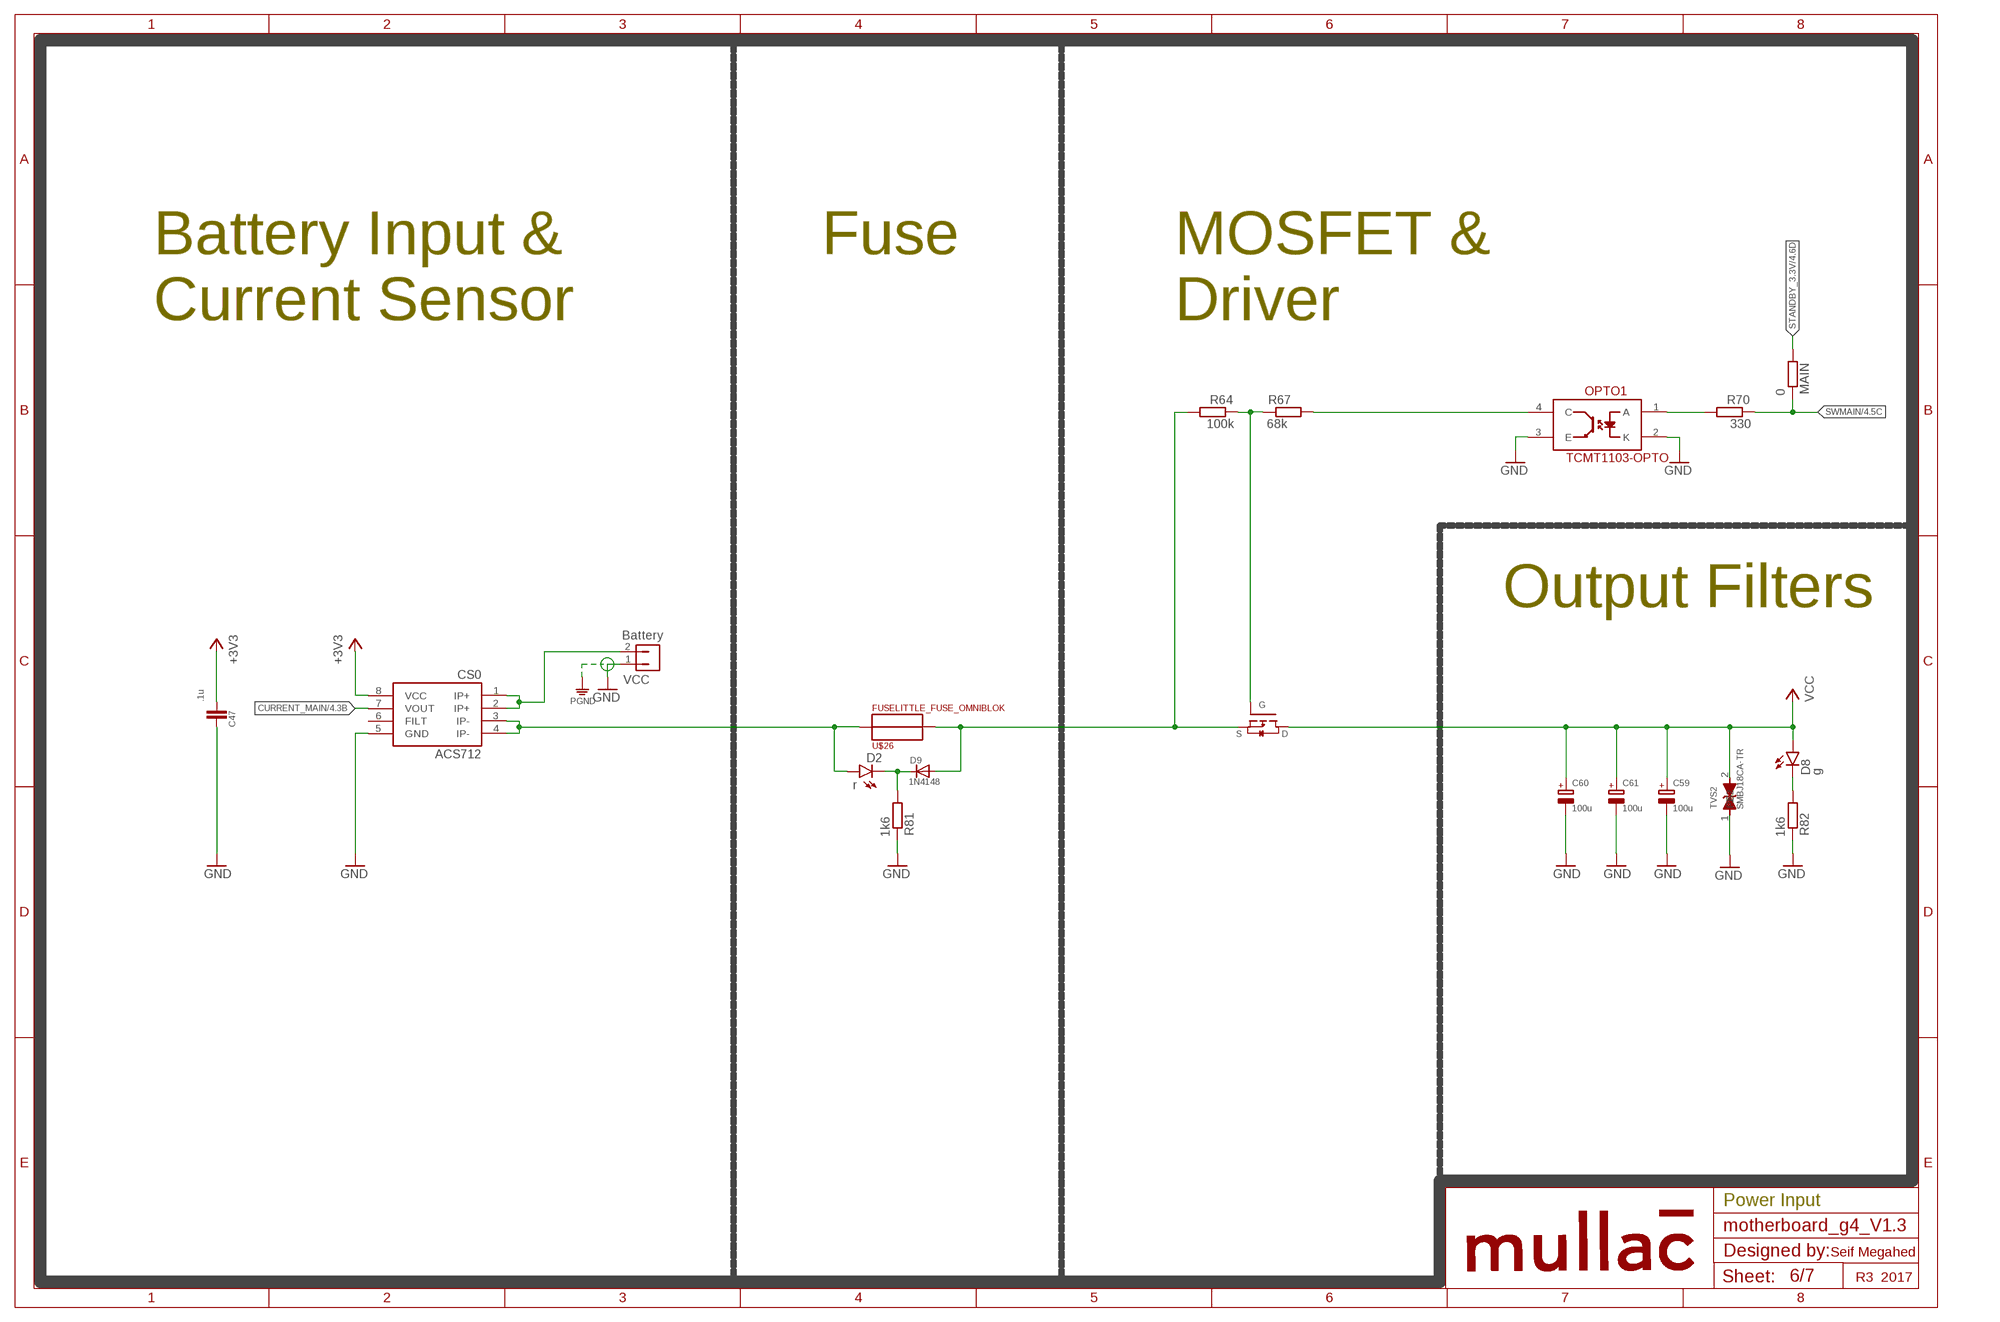
[diagram p5: schematic, sheet 6]

### Parts
C47  .1u  CAPACITOR_0603  [0603]
C59  100u  CAPACITOR_POLA_EEEFK1V101XP  [AE_CAP_D]
C60  100u  CAPACITOR_POLA_EEEFK1V101XP  [AE_CAP_D]
C61  100u  CAPACITOR_POLA_EEEFK1V101XP  [AE_CAP_D]
CS0  ACS712  [SO08]
D2  r  LED0603  [LED-0603]
D8  g  LED0603  [LED-0603]
D9  1N4148  DIODESOD-80  [SOD-80]
MAIN  0  RESISTOR_0603  [0603]
OPTO1  TCMT1103-OPTO  [SSOP-4]
R64  100k  RESISTOR_0603  [0603]
R67  68k  RESISTOR_0603  [0603]
R70  330  RESISTOR_0603  [0603]
R81  1k6  RESISTOR_0603  [0603]
R82  1k6  RESISTOR_0603  [0603]
TVS2  SMBJ18CA-TR  TVS-DIODE_IPC_7531  [IPC_7531]
U$26  FUSELITTLE_FUSE_OMNIBLOK  [OMNI_BLOK]
U$30  MOSFETSIR401DP  [POWERPAK_SO-8]
VCC  Battery  MOLEX_2_RIGHT  [MOLEX_2_RIGHT]

### Nets
+3V3: C47.P$2 CS0.8(VCC) ; also sheet 1,2,3,4,5,7
BAT: CS0.1(IP+) CS0.2(IP+) VCC.2
CURRENT_MAIN: CS0.7(VOUT) ; also sheet 4
GND: C47.P$1 C59.- C60.- C61.- CS0.5(GND) OPTO1.2(K) OPTO1.3(E) R81.P$1 R82.P$1 TVS2.1 VCC.1 ; also sheet 1,2,3,4,5,7
MOSFET_GATE: OPTO1.4(C) R67.P$2
N$20: R64.P$1 R67.P$1 U$30.4(G)
N$23: OPTO1.1(A) R70.P$2
N$62: D2.C D9.2(C) R81.P$2
N$69: D8.C R82.P$2
PRE_VCC: CS0.3(IP-) CS0.4(IP-) D2.A U$26.P$1 ; also sheet 4,7
S: D9.1(A) R64.P$2 U$26.P$2 U$30.1(S) U$30.2(S) U$30.3(S)
STANDBY_3.3V: MAIN.P$2 ; also sheet 4,7
SWMAIN: MAIN.P$1 R70.P$1 ; also sheet 4
VCC: C59.+ C60.+ C61.+ D8.A TVS2.2 U$30.5(D) U$30.6(D) U$30.7(D) U$30.8(D) U$30.EP(D) ; also sheet 1,2,3,7
Unconnected: CS0.6(FILT)

### Notes on the sheet
- Battery Input &
  Current Sensor
- Fuse
- MOSFET & 
  Driver
- Output Filters
- Power Input
- Seif Megahed
- R3 | 2017

## Sheet 7 of 7: Power Supplies
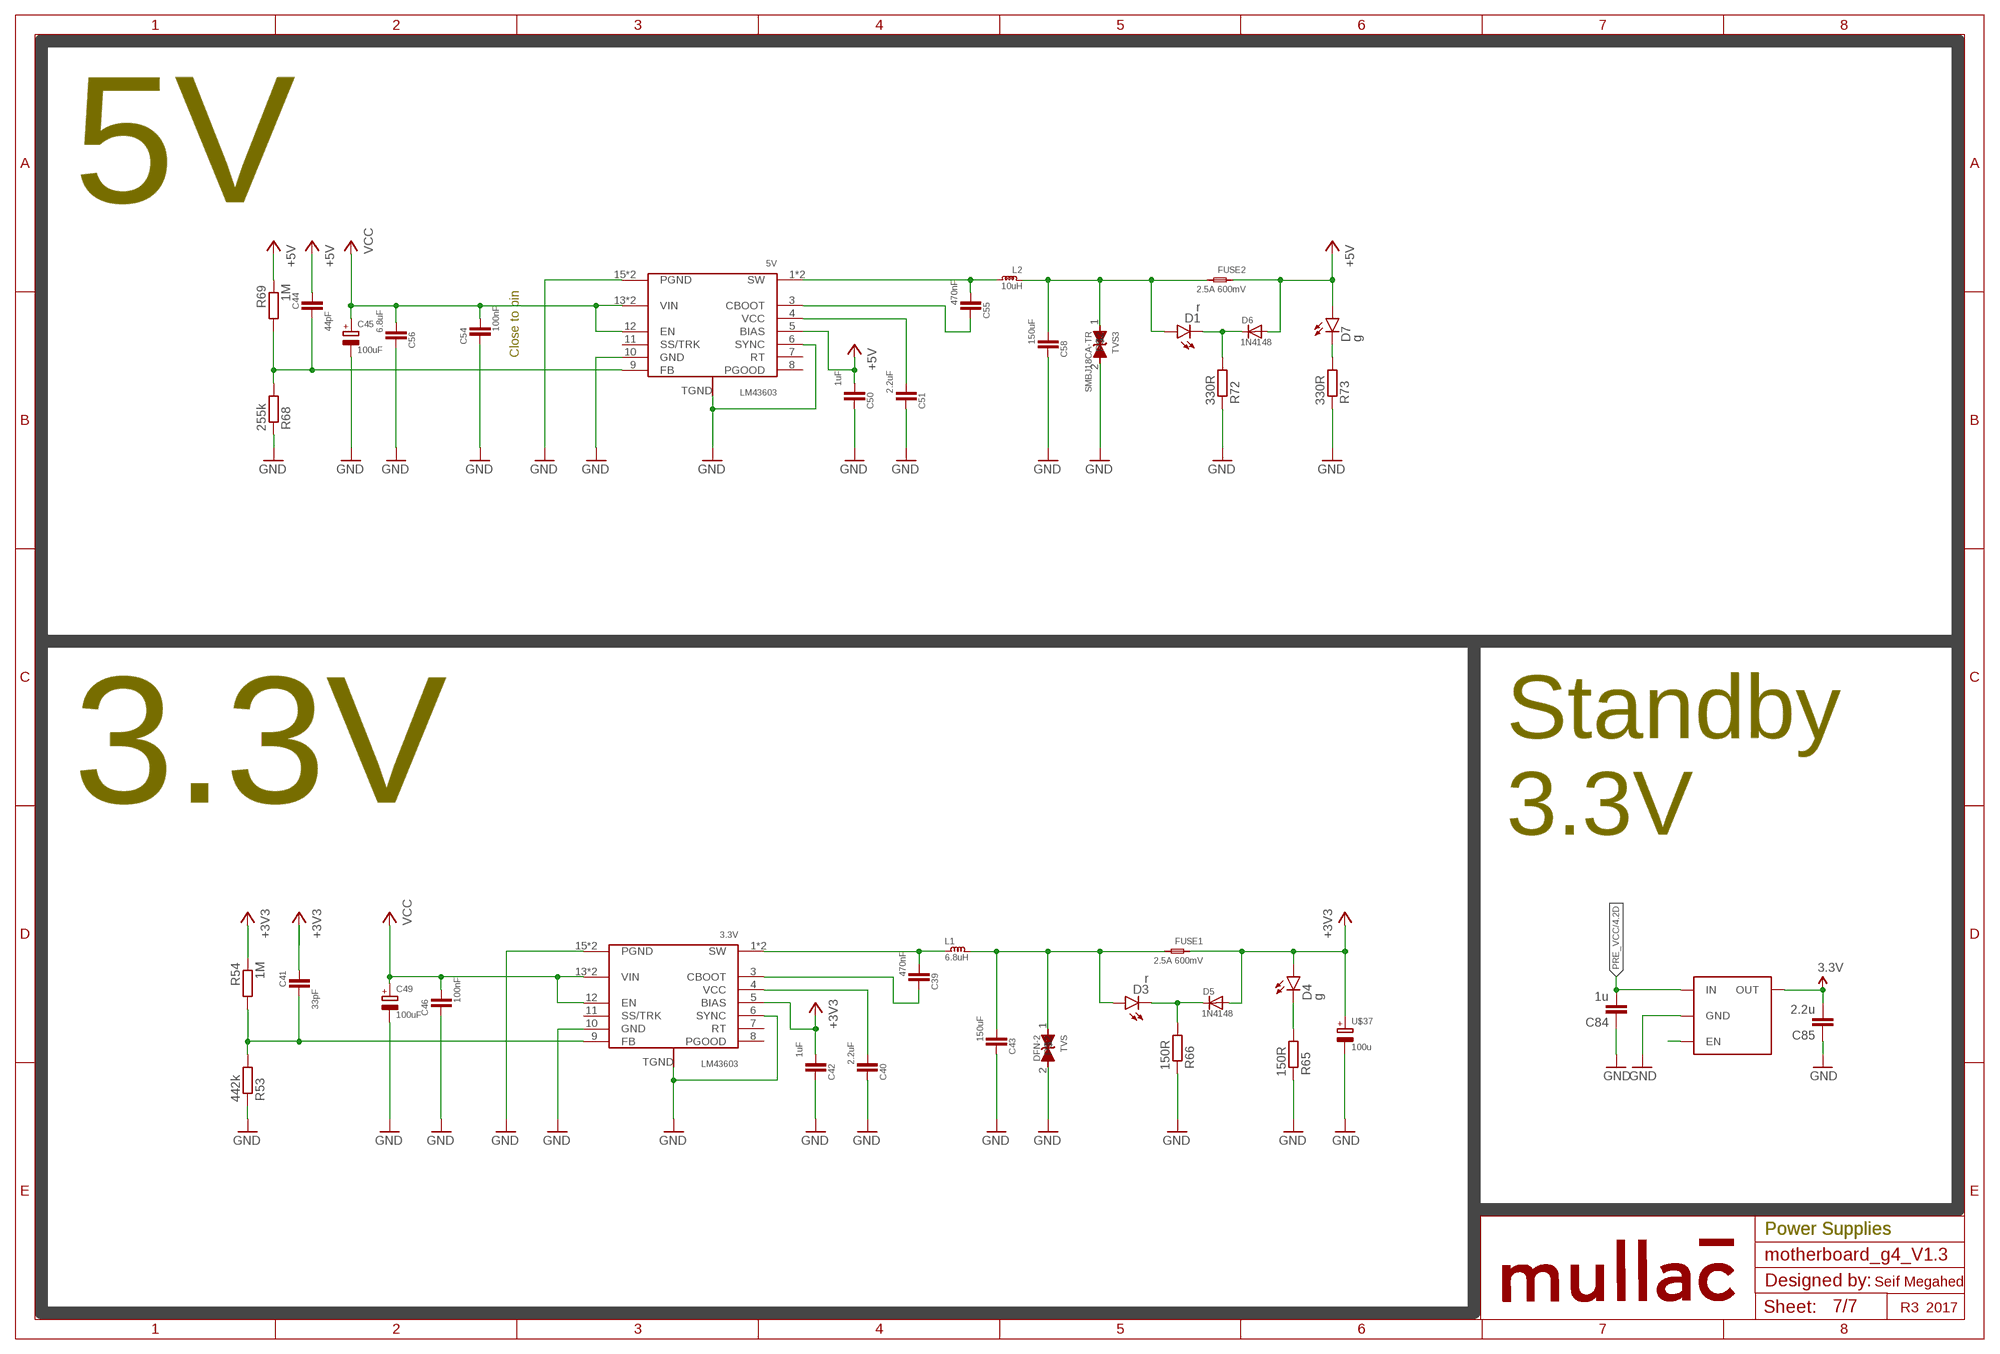
[diagram p6: schematic, sheet 7]

### Parts
3  http://nl.farnell.com/texas-instruments/tps709b33dbvt/ldo-fixed-3-3v-0-15a-sot-23-5/dp/2527035  TPS709  [SOT23-5]
3.3V  LM43603  [HTSSOP16]
5V  LM43603  [HTSSOP16]
C39  470nF  CAPACITOR_0603  [0603]
C40  2.2uF  CAPACITOR_0603  [0603]
C41  33pF  CAPACITOR_0603  [0603]
C42  1uF  CAPACITOR_0603  [0603]
C43  150uF  CAPACITOR_1206  [1206]
C44  44pF  CAPACITOR_0603  [0603]
C45  100uF  CAPACITOR_POLA_EEEFK1V101XP  [AE_CAP_D]
C46  100nF  CAPACITOR_0603  [0603]
C49  100uF  CAPACITOR_POLA_EEEFK1V101XP  [AE_CAP_D]
C50  1uF  CAPACITOR_0603  [0603]
C51  2.2uF  CAPACITOR_0603  [0603]
C54  100nF  CAPACITOR_0603  [0603]
C55  470nF  CAPACITOR_0603  [0603]
C56  6.8uF  CAPACITOR  [0805]
C58  150uF  CAPACITOR_1206  [1206]
C84  1u  CAP_0603  [CAP_0603]
C85  2.2u  CAP_0603  [CAP_0603]
D1  r  LED0603  [LED-0603]
D3  r  LED0603  [LED-0603]
D4  g  LED0603  [LED-0603]
D5  1N4148  DIODESOD-80  [SOD-80]
D6  1N4148  DIODESOD-80  [SOD-80]
D7  g  LED0603  [LED-0603]
FUSE1  2.5A 600mV  FUSE1812  [1812]
FUSE2  2.5A 600mV  FUSE1812  [1812]
L1  6.8uH  INDUCTOR_2  [WE-PD2SR/7850]
L2  10uH  INDUCTOR_1054  [WE-PD2/1054]
R53  442k  RESISTOR_0603  [0603]
R54  1M  RESISTOR_0603  [0603]
R65  150R  RESISTOR_0603  [0603]
R66  150R  RESISTOR_0603  [0603]
R68  255k  RESISTOR_0603  [0603]
R69  1M  RESISTOR_0603  [0603]
R72  330R  RESISTOR_0603  [0603]
R73  330R  RESISTOR_0603  [0603]
TVS  DFN-2  TVS-DIODE  [DFN-2]
TVS3  SMBJ18CA-TR  TVS-DIODE_IPC_7531  [IPC_7531]
U$37  100u  CAPACITOR_POLA_EEEFK1V101XP  [AE_CAP_D]

### Nets
+3V1: C43.P$2 D3.A FUSE1.2 L1.2 TVS.1
+3V3: 3.3V.5(BIAS) C41.P$1 C42.P$2 D4.A D5.1(A) FUSE1.1 R54.P$1 U$37.+ ; also sheet 1,2,3,4,5,6
+5V: 5V.5(BIAS) C44.P$1 C50.P$2 D6.1(A) D7.A FUSE2.1 R69.P$1 ; also sheet 1,2,3
EN: 3.3(EN)
GND: 3.2(GND) 3.3V.6(SYNC) 3.3V.10(GND) 3.3V.15(PGND) 3.3V.16(PGND) 3.3V.TGND(AGND) 5V.6(SYNC) 5V.10(GND) 5V.15(PGND) 5V.16(PGND) 5V.TGND(AGND) C40.P$1 C42.P$1 C43.P$1 C45.- C46.P$1 C49.- C50.P$1 C51.P$1 C54.P$1 C56.1 C58.P$1 C84.1 C85.1 R53.P$1 R65.P$1 R66.P$1 R68.P$1 R72.P$1 R73.P$1 TVS3.2 TVS.2 U$37.- ; also sheet 1,2,3,4,5,6
N$57: 3.3V.3(CBOOT) C39.P$1
N$58: 3.3V.4(VCC) C40.P$2
N$59: 3.3V.9(FB) C41.P$2 R53.P$2 R54.P$2
N$61: 3.3V.1(SW) 3.3V.2(SW) C39.P$2 L1.1
N$63: D3.C D5.2(C) R66.P$2
N$64: 5V.3(CBOOT) C55.P$1
N$65: 5V.4(VCC) C51.P$2
N$66: 5V.9(FB) C44.P$2 R68.P$2 R69.P$2
N$67: 5V.1(SW) 5V.2(SW) C55.P$2 L2.P$2
N$68: D1.C D6.2(C) R72.P$2
N$70: D4.C R65.P$2
N$71: D7.C R73.P$2
PRE_VCC: 3.1(IN) C84.2 ; also sheet 4,6
STANDBY_3.3V: 3.5(OUT) C85.2 ; supply symbol labelled 3.3V ; also sheet 4,6
VCC: 3.3V.12(EN) 3.3V.13(VIN) 3.3V.14(VIN) 5V.12(EN) 5V.13(VIN) 5V.14(VIN) C45.+ C46.P$2 C49.+ C54.P$2 C56.2 ; also sheet 1,2,3,6
VCC3: C58.P$2 D1.A FUSE2.2 L2.P$1 TVS3.1
Unconnected: 3.3V.7(RT) 3.3V.8(PGOOD) 3.3V.11(SS/TRK) 5V.7(RT) 5V.8(PGOOD) 5V.11(SS/TRK)

### Notes on the sheet
- 5V
- Close to pin
- 3.3V
- Standby 
  3.3V
- Power Supplies | Power Supplies
- Seif Megahed
- R3 | 2017

## Power pins joined to a net without a drawn wire
VBUS: USB1.1(VBUS)

## Library data of the parts
3 = Mullac:TPS709
3.3V 5V = RoboCup:LM43603
6MHZ = SparkFun-FreqCtrl:OSCILLATOR: Generic 5x3 and 7x5 oscillators
C1-C38 C52 C53 C75-C77 C80-C89 C91 C92 D L = Mullac:CAP
C39-C44 C46 C47 C50 C51 C54-C56 C58 = RoboCup:CAPACITOR
C45 C49 C59-C61 U$11-U$14 U$16 U$17 U$37 = RoboCup:CAPACITOR_POLA
C48 C57 C62-C74 C79 = rcl:CPOL-EU: POLARIZED CAPACITOR, European symbol
CN1 = Mullac:SWD_0171_PH127-205DF055G00A: 2x5 Header 1,27
CS0 CS1-CS6 = SparkFun-AnalogIC:ACS712: Hall-effect-based isolated linear current sensor; PROD_ID: IC-08964
D1-D4 D7 D8 D11 D17 D20 D21 = SparkFun-LED:LED: LEDs Standard schematic elements and footprints for 5mm, 3mm, 1206, and 0603 sized LEDs. 5mm - Spark Fun Electronics SKU : COM-00529 (and others)
D5 D6 D9 = RoboCup:DIODE
D10 D12-D16 D18 D19 D22-D25 = Mullac:PRTR5V0U2X: Ultra low capacitance double rail-to-rail ESD protection diode
D26 = diode:ZENER-DIODE: Z-Diode
FUSE1 FUSE2 = RoboCup:FUSE
JP1 = pinhead:PINHD-1X2: PIN HEADER
L1 L2 = RoboCup:INDUCTOR
LED1-LED5 = led:LED: LED OSRAM: - CHIPLED LG R971, LG N971, LY N971, LG Q971, LY Q971, LO R971, LY R971 LH N974, LH R974 LS Q976, LO Q976, LY Q976 LO Q996 - Hyper CHIPLED LW Q18S LB Q993, LB Q99A, LB R99A - SideLED LS A670, LO A670, LY A670, LG A670, LP A670 LB A673, LV A673, LT A673, LW A673 LH A674 LY A675 LS A676, LA A676, LO A676, LY A676, LW A676 LS A679, LY A679, LG A679 - Hyper Micro SIDELED® LS Y876, LA Y876, LO Y876, LY Y876 LT Y87S - SmartLED LW L88C, LW L88S LB L89C, LB L89S, LG L890 LS L89K, LO L89K, LY L89K LS L896, LA L896, LO L896, LY L896 - TOPLED LS T670, LO T670, LY T670, LG T670, LP T670 LSG T670, LSP T670, LSY T670, LOP T670, LYG T670 LG T671, LOG T671, LSG T671 LB T673, LV T673, LT T673, LW T673 LH T674 LS T676, LA T676, LO T676, LY T676, LB T676, LH T676, LSB T676, LW T676 LB T67C, LV T67C, LT T67C, LS T67K, LO T67K, LY T67K, LW E67C LS E67B, LA E67B, LO E67B, LY E67B, LB E67C, LV E67C, LT E67C LW T67C LS T679, LY T679, LG T679 LS T770, LO T770, LY T770, LG T770, LP T770 LB T773, LV T773, LT T773, LW T773 LH T774 LS E675, LA E675, LY E675, LS T675 LS T776, LA T776, LO T776, LY T776, LB T776 LHGB T686 LT T68C, LB T68C - Hyper Mini TOPLED® LB M676 - Mini TOPLED Santana® LG M470 LS M47K, LO M47K, LY M47K Source: http://www.osram.convergy.de LUXEON: - LUMILED® LXK2-PW12-R00, LXK2-PW12-S00, LXK2-PW14-U00, LXK2-PW14-V00 LXK2-PM12-R00, LXK2-PM12-S00, LXK2-PM14-U00 LXK2-PE12-Q00, LXK2-PE12-R00, LXK2-PE12-S00, LXK2-PE14-T00, LXK2-PE14-U00 LXK2-PB12-K00, LXK2-PB12-L00, LXK2-PB12-M00, LXK2-PB14-N00, LXK2-PB14-P00, LXK2-PB14-Q00 LXK2-PR12-L00, LXK2-PR12-M00, LXK2-PR14-Q00, LXK2-PR14-R00 LXK2-PD12-Q00, LXK2-PD12-R00, LXK2-PD12-S00 LXK2-PH12-R00, LXK2-PH12-S00 LXK2-PL12-P00, LXK2-PL12-Q00, LXK2-PL12-R00 Source: www.luxeon.com KINGBRIGHT: KA-3528ASYC Source: www.kingbright.com
MAIN R36-R39 R53 R54 R64-R70 R72 R73 R81 R82 = RoboCup:RESISTOR
NOT1 NOT2 = Mullac:NOT_GATE
OPTO1 = SparkFun-DiscreteSemi:TCMT1103-OPTO: Optoisolator- NPN output
R1-R35 R40-R52 R55-R63 R71 R74-R80 R83-R85 R87 = Mullac:RES
TVS TVS2 TVS3 = RoboCup:TVS-DIODE
U1 = Mullac:TUSB2077A
U2 = Mullac:ATSAML
U$1-U$3 U$5-U$8 = Mullac:SSH-G4-MODULE
U$4 = Mullac:SSH-G4-CPU
U$26 = Mullac:FUSE
U$30 = Mullac:MOSFET
U$31 U$32 = Mullac:TACT-SWITCH
USB1 = Mullac:USB-CON-5PIN: Molex Micro USB 105017-0001
VCC = RoboCup:MOLEX_2
X2 = Mullac:CRYSTAL

## Net classes
1 Differential: width 0.3 mm, drill 0.2 mm, clearance 0.15 mm